# Altium project CCZynq.PrjPCB (part 1 of 2)
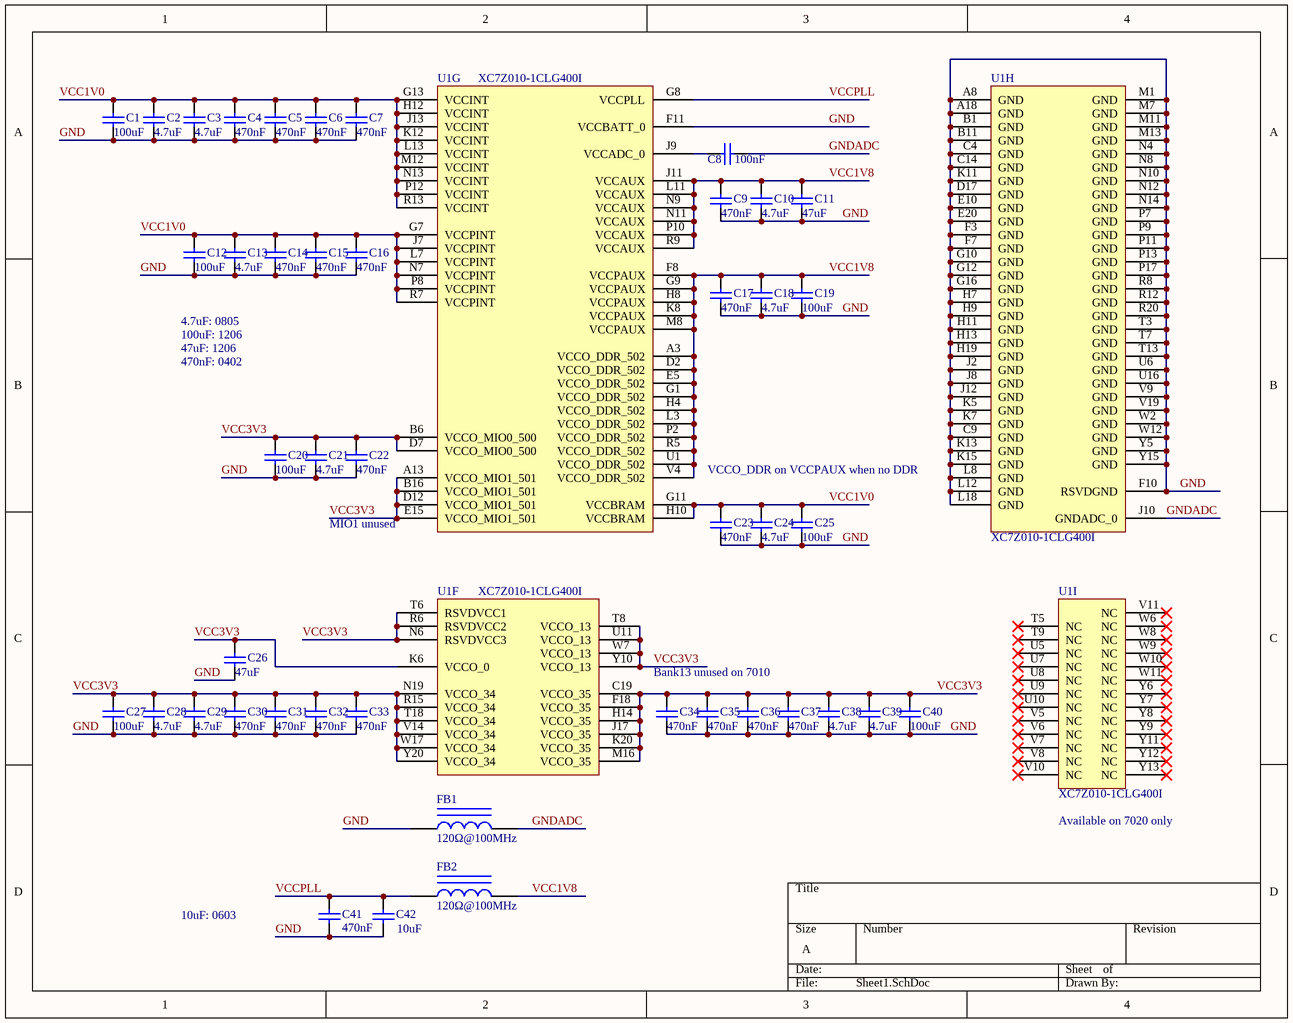
[diagram p0: Sheet1.SchDoc]
7 sheets, 247 parts. Net scope: global (net labels, ports and power ports of the same name join across sheets).
Board file: CCZynq.PcbDoc
Sheets:
  Sheet1.SchDoc
  Sheet2.SchDoc
  Sheet3.SchDoc
  Sheet4.SchDoc
  Sheet6.SchDoc
  Sheet5.SchDoc
  Sheet7.SchDoc

## Sheet Sheet1.SchDoc: SqueakyBoard
size A

### Parts
C1  100uF  [1206_C]
C2  4.7uF  [0805_C]
C3  4.7uF  [0805_C]
C4  470nF  [0402_C]
C5  470nF  [0402_C]
C6  470nF  [0402_C]
C7  470nF  [0402_C]
C8  100nF  [1206_C]
C9  470nF  [0402_C]
C10  4.7uF  [0805_C]
C11  47uF  [1206_C]
C12  100uF  [1206_C]
C13  4.7uF  [0805_C]
C14  470nF  [0402_C]
C15  470nF  [0402_C]
C16  470nF  [0402_C]
C17  470nF  [0402_C]
C18  4.7uF  [0805_C]
C19  100uF  [1206_C]
C20  100uF  [1206_C]
C21  4.7uF  [0805_C]
C22  470nF  [0402_C]
C23  470nF  [0402_C]
C24  4.7uF  [0805_C]
C25  100uF  [1206_C]
C26  47uF  [1206_C]
C27  100uF  [1206_C]
C28  4.7uF  [0805_C]
C29  4.7uF  [0805_C]
C30  470nF  [0402_C]
C31  470nF  [0402_C]
C32  470nF  [0402_C]
C33  470nF  [0402_C]
C34  470nF  [0402_C]
C35  470nF  [0402_C]
C36  470nF  [0402_C]
C37  470nF  [0402_C]
C38  4.7uF  [0805_C]
C39  4.7uF  [0805_C]
C40  100uF  [1206_C]
C41  470nF  [0402_C]
C42  10uF  [0603_C]
FB1  120Ω@100MHz  [0805_L]
FB2  120Ω@100MHz  [0805_L]
U1  XC7Z010-1CLG400I  [CLG400]  (parts F,G,H,I of 9)

### Nets
GND: C1.2 C2.2 C3.2 C4.2 C5.2 C6.2 C7.2 C9.1 C10.1 C11.1 C12.2 C13.2 C14.2 C15.2 C16.2 C17.1 C18.1 C19.1 C20.2 C21.2 C22.2 C23.1 C24.1 C25.1 C26.1 C27.2 C28.2 C29.2 C30.2 C31.2 C32.2 C33.2 C34.2 C35.2 C36.2 C37.2 C38.2 C39.2 C40.2 C41.1 C42.1 FB1.1 U1.A8(GND) U1.A18(GND) U1.B1(GND) U1.B11(GND) U1.C4(GND) U1.C9(GND) U1.C14(GND) U1.D17(GND) U1.E10(GND) U1.E20(GND) U1.F3(GND) U1.F7(GND) U1.F10(RSVDGND) U1.F11(VCCBATT_0) U1.G10(GND) U1.G12(GND) U1.G16(GND) U1.H7(GND) U1.H9(GND) U1.H11(GND) U1.H13(GND) U1.H19(GND) U1.J2(GND) U1.J8(GND) U1.J12(GND) U1.K5(GND) U1.K7(GND) U1.K11(GND) U1.K13(GND) U1.K15(GND) U1.L8(GND) U1.L12(GND) U1.L18(GND) U1.M1(GND) U1.M7(GND) U1.M11(GND) U1.M13(GND) U1.N4(GND) U1.N8(GND) U1.N10(GND) U1.N12(GND) U1.N14(GND) U1.P7(GND) U1.P9(GND) U1.P11(GND) U1.P13(GND) U1.P17(GND) U1.R8(GND) U1.R12(GND) U1.R20(GND) U1.T3(GND) U1.T7(GND) U1.T13(GND) U1.U6(GND) U1.U16(GND) U1.V9(GND) U1.V19(GND) U1.W2(GND) U1.W12(GND) U1.Y5(GND) U1.Y15(GND)
GNDADC: C8.2 FB1.2 U1.J10(GNDADC_0)
VCC1V0: C1.1 C2.1 C3.1 C4.1 C5.1 C6.1 C7.1 C12.1 C13.1 C14.1 C15.1 C16.1 C23.2 C24.2 C25.2 U1.G7(VCCPINT) U1.G11(VCCBRAM) U1.G13(VCCINT) U1.H10(VCCBRAM) U1.H12(VCCINT) U1.J7(VCCPINT) U1.J13(VCCINT) U1.K12(VCCINT) U1.L7(VCCPINT) U1.L13(VCCINT) U1.M12(VCCINT) U1.N7(VCCPINT) U1.N13(VCCINT) U1.P8(VCCPINT) U1.P12(VCCINT) U1.R7(VCCPINT) U1.R13(VCCINT)
VCC1V8: C9.2 C10.2 C11.2 C17.2 C18.2 C19.2 FB2.2 U1.A3(VCCO_DDR_502) U1.D2(VCCO_DDR_502) U1.E5(VCCO_DDR_502) U1.F8(VCCPAUX) U1.G1(VCCO_DDR_502) U1.G9(VCCPAUX) U1.H4(VCCO_DDR_502) U1.H8(VCCPAUX) U1.J11(VCCAUX) U1.K8(VCCPAUX) U1.L3(VCCO_DDR_502) U1.L11(VCCAUX) U1.M8(VCCPAUX) U1.N9(VCCAUX) U1.N11(VCCAUX) U1.P2(VCCO_DDR_502) U1.P10(VCCAUX) U1.R5(VCCO_DDR_502) U1.R9(VCCAUX) U1.U1(VCCO_DDR_502) U1.V4(VCCO_DDR_502)
VCC3V3: C20.1 C21.1 C22.1 C26.2 C27.1 C28.1 C29.1 C30.1 C31.1 C32.1 C33.1 C34.1 C35.1 C36.1 C37.1 C38.1 C39.1 C40.1 U1.A13(VCCO_MIO1_501) U1.B6(VCCO_MIO0_500) U1.B16(VCCO_MIO1_501) U1.C19(VCCO_35) U1.D7(VCCO_MIO0_500) U1.D12(VCCO_MIO1_501) U1.E15(VCCO_MIO1_501) U1.F18(VCCO_35) U1.H14(VCCO_35) U1.J17(VCCO_35) U1.K6(VCCO_0) U1.K20(VCCO_35) U1.M16(VCCO_35) U1.N6(RSVDVCC3) U1.N19(VCCO_34) U1.R6(RSVDVCC2) U1.R15(VCCO_34) U1.T6(RSVDVCC1) U1.T8(VCCO_13) U1.T18(VCCO_34) U1.U11(VCCO_13) U1.V14(VCCO_34) U1.W7(VCCO_13) U1.W17(VCCO_34) U1.Y10(VCCO_13) U1.Y20(VCCO_34)
VCCPLL: C41.2 C42.2 FB2.1 U1.G8(VCCPLL)
NetC8_1: C8.1 U1.J9(VCCADC_0)

Not connected (* = marked no-connect by the designer): U1 T5(NC)* T9(NC)* U5(NC)* U7(NC)* U8(NC)* U9(NC)* U10(NC)* V5(NC)* V6(NC)* V7(NC)* V8(NC)* V10(NC)* V11(NC)* W6(NC)* W8(NC)* W9(NC)* W10(NC)* W11(NC)* Y6(NC)* Y7(NC)* Y8(NC)* Y9(NC)* Y11(NC)* Y12(NC)* Y13(NC)*

### Notes on the sheet
- 4.7uF: 0805
- 100uF: 1206
- 47uF: 1206
- 470nF: 0402
- VCCO_DDR on VCCPAUX when no DDR
- MIO1 unused
- Bank13 unused on 7010
- (near U1) Available on 7020 only
- 10uF: 0603
- Title
- Size:
- Date:
- A
- Number:
- Time:
- Revision:
- Sheet
- of
- File:

### Library data of the parts
C1 C11 C12 C19 C20 C25-C27 C40 = 1206 10uF (106) 10% 50V: 贴片电容; ComponentLink1Description: 供应商链接; ComponentLink1URL: http://www.szlcsc.com/product/details_14236.html; Package: 1206; Supplier: LC; SuppliersPartNumber: C13585
C2 C3 C10 C13 C18 C21 C24 C28 C29 C38 C39 = 0805 4.7uF (475) 10% 25V: 贴片电容; ComponentLink1Description: 供应商链接; ComponentLink1URL: http://www.szlcsc.com/product/details_2131.html; Package: 0805; Supplier: LC; SuppliersPartNumber: C1779
C4-C7 C9 C14-C17 C22 C23 C30-C37 C41 = 0402 470nF (474) 10% 10V: 贴片电容; ComponentLink1Description: 供应商链接; ComponentLink1URL: http://www.szlcsc.com/product/details_48344.html; Package: 0402; Supplier: LC; SuppliersPartNumber: C47339
C8 = 1206 100nF (104) 10% 50V: 贴片电容; ComponentLink1Description: 供应商链接; ComponentLink1URL: http://www.szlcsc.com/product/details_25237.html; Package: 1206; Supplier: LC; SuppliersPartNumber: C24497
C42 = 0603 10uF (106) 10% 10V: 贴片电容; ComponentLink1Description: 供应商链接; ComponentLink1URL: http://www.szlcsc.com/product/details_20411.html; Package: 0603; Supplier: LC; SuppliersPartNumber: C19702
FB1 FB2 = 0805 600Ω 25% 100MHz: 贴片磁珠; ComponentLink1Description: 供应商链接; ComponentLink1URL: http://www.szlcsc.com/product/details_1369.html; Package: 0805; Supplier: LC; SuppliersPartNumber: C1017
U1 = XC7Z010-1CLG400I: 667 MHz Zynq?7000 AP SoC, 130 PS I/O, 100 FPGA I/O, 400-Ball BGA, Speed Grade 1, Industrial Grade, Pb-Free; Manufacturer: Xilinx; Extensible Block RAM (# 36Kb Blocks): 240 KB (60); Flip Flops: 35200; LUTs: 17600; Speed Grade: -1; DatasheetVersion: v1.2; PackageVersion: Rev 1.1; PackageReference: CLG400; PackageDescription: Wire-Bond Chip-Scale BGA, Body 17 x 17 mm, 0.8 mm Pitch; Generic Part Number: XC7Z010; RoHS: Pb-Free; Mounting Technology: Surface Mount; Code_JEDEC: MO-275-MMAA-1; PartNumber: XC7Z010-1CLG400I; ComponentLink1Description: Datasheet; ComponentLink1URL: http://www.xilinx.com/support/documentation/data_sheets/ds190-Zynq-7000-Overview.pdf; ComponentLink2Description: Package Specification; ComponentLink2URL: http://www.xilinx.com/support/documentation/user_guides/ug865-Zynq-7000-Pkg-Pinout.pdf; ComponentLink3Description: DC and AC Switching Characteristics; ComponentLink3URL: http://www.xilinx.com/support/documentation/data_sheets/ds187-XC7Z010-XC7Z020-Data-Sheet.pdf; ComponentLink4Description: Package File; ComponentLink4URL: http://www.xilinx.com/support/packagefiles/z7packages/xc7z010clg400pkg.txt; ComponentLink5Description: Packaging and Pinout; ComponentLink5URL: http://www.xilinx.com/support/documentation/user_guides/ug865-Zynq-7000-Pkg-Pinout.pdf; ComponentLink6Description: PCB and Layout Guide; ComponentLink6URL: http://www.xilinx.com/support/documentation/user_guides/ug483_7Series_PCB.pdf

## Sheet Sheet2.SchDoc
size A
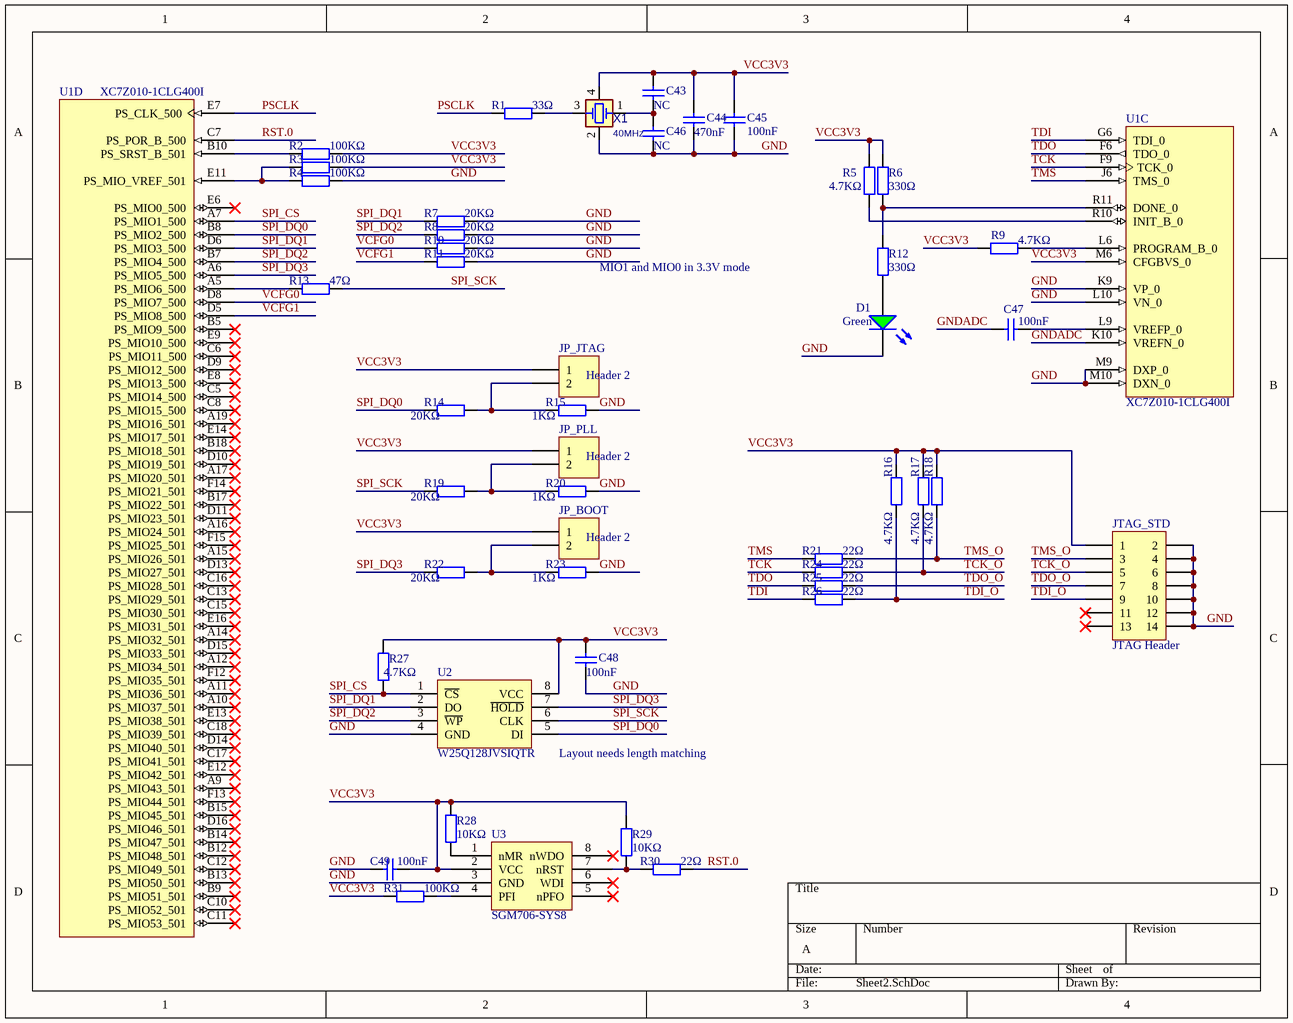
[diagram p1: Sheet2.SchDoc]

### Parts
C43  NC  [0402_C]
C44  470nF  [0402_C]
C45  100nF  [1206_C]
C46  NC  [0402_C]
C47  100nF  [1206_C]
C48  100nF  [1206_C]
C49  100nF  [1206_C]
D1  Green  [0805_LED_S1]
JP_BOOT  Header 2  [HDR1X2]
JP_JTAG  Header 2  [HDR1X2]
JP_PLL  Header 2  [HDR1X2]
JTAG_STD  JTAG Header  [HDR2X7]
R1  33Ω  [0603_R]
R2  100KΩ  [1206_R]
R3  100KΩ  [1206_R]
R4  100KΩ  [1206_R]
R5  4.7KΩ  [1206_R]
R6  330Ω  [0805_R]
R7  20KΩ  [0805_R]
R8  20KΩ  [0805_R]
R9  4.7KΩ  [1206_R]
R10  20KΩ  [0805_R]
R11  20KΩ  [0805_R]
R12  330Ω  [0805_R]
R13  47Ω  [0805_R]
R14  20KΩ  [0805_R]
R15  1KΩ  [1206_R]
R16  4.7KΩ  [1206_R]
R17  4.7KΩ  [1206_R]
R18  4.7KΩ  [1206_R]
R19  20KΩ  [0805_R]
R20  1KΩ  [1206_R]
R21  22Ω  [1206_R]
R22  20KΩ  [0805_R]
R23  1KΩ  [1206_R]
R24  22Ω  [1206_R]
R25  22Ω  [1206_R]
R26  22Ω  [1206_R]
R27  4.7KΩ  [1206_R]
R28  10KΩ  [1206_R]
R29  10KΩ  [1206_R]
R30  22Ω  [1206_R]
R31  100KΩ  [1206_R]
U1  XC7Z010-1CLG400I  [CLG400]  (parts C,D of 9)
U2  W25Q128JVSIQTR  [SOIC-8_208mil]
U3  SGM706-SYS8  [SOIC-8_150mil]
X1  40MHz  [XTL_4_3225]

### Nets
GND: C44.2 C45.1 C46.2 C48.1 C49.1 D1.K JTAG_STD.2 JTAG_STD.4 JTAG_STD.6 JTAG_STD.8 JTAG_STD.10 JTAG_STD.12 JTAG_STD.14 R4.2 R7.2 R8.2 R10.2 R11.2 R15.2 R20.2 R23.2 U1.K9(VP_0) U1.L10(VN_0) U1.M9(DXP_0) U1.M10(DXN_0) U2.4(GND) U3.3(GND) X1.2(GND1)
GNDADC: C47.1 U1.K10(VREFN_0)
PSCLK: R1.1 U1.E7(PS_CLK_500)
RST.0: R30.2 U1.C7(PS_POR_B_500)
SPI_CS: R27.1 U1.A7(PS_MIO1_500) U2.1(~{CS})
SPI_DQ0: R14.1 U1.B8(PS_MIO2_500) U2.5(DI)
SPI_DQ1: R7.1 U1.D6(PS_MIO3_500) U2.2(DO)
SPI_DQ2: R8.1 U1.B7(PS_MIO4_500) U2.3(~{WP})
SPI_DQ3: R22.1 U1.A6(PS_MIO5_500) U2.7(~{HOLD})
SPI_SCK: R13.2 R19.1 U2.6(CLK)
TCK: R24.1 U1.F9(TCK_0)
TCK_O: JTAG_STD.5 R17.1 R24.2
TDI: R26.1 U1.G6(TDI_0)
TDI_O: JTAG_STD.9 R16.1 R26.2
TDO: R25.1 U1.F6(TDO_0)
TDO_O: JTAG_STD.7 R25.2
TMS: R21.1 U1.J6(TMS_0)
TMS_O: JTAG_STD.3 R18.1 R21.2
VCC3V3: C43.1 C44.1 C45.2 C48.2 C49.2 JP_BOOT.1 JP_JTAG.1 JP_PLL.1 JTAG_STD.1 R2.2 R3.2 R5.2 R6.1 R9.1 R16.2 R17.2 R18.2 R27.2 R28.2 R29.2 R31.1 U1.M6(CFGBVS_0) U2.8(VCC) U3.2(VCC) X1.4(GND2)
VCFG0: R10.1 U1.D8(PS_MIO7_500)
VCFG1: R11.1 U1.D5(PS_MIO8_500)
NetC43_2: C43.2 C46.1 X1.1(XA)
NetC47_2: C47.2 U1.L9(VREFP_0)
NetD1_A: D1.A R12.1
NetJP_BOOT_2: JP_BOOT.2 R22.2 R23.1
NetJP_JTAG_2: JP_JTAG.2 R14.2 R15.1
NetJP_PLL_2: JP_PLL.2 R19.2 R20.1
NetR1_2: R1.2 X1.3(XB)
NetR2_1: R2.1 U1.B10(PS_SRST_B_501)
NetR3_1: R3.1 R4.1 U1.E11(PS_MIO_VREF_501)
NetR5_1: R5.1 U1.R10(INIT_B_0)
NetR6_2: R6.2 R12.2 U1.R11(DONE_0)
NetR9_2: R9.2 U1.L6(PROGRAM_B_0)
NetR13_1: R13.1 U1.A5(PS_MIO6_500)
NetR28_1: R28.1 U3.1(nMR)
NetR29_1: R29.1 R30.1 U3.7(nRST)
NetR31_2: R31.2 U3.4(PFI)

Not connected (* = marked no-connect by the designer): JTAG_STD 11* 13*; U1 A9(PS_MIO43_501)* A10(PS_MIO37_501)* A11(PS_MIO36_501)* A12(PS_MIO34_501)* A14(PS_MIO32_501)* A15(PS_MIO26_501)* A16(PS_MIO24_501)* A17(PS_MIO20_501)* A19(PS_MIO16_501)* B5(PS_MIO9_500)* B9(PS_MIO51_501)* B12(PS_MIO48_501)* B13(PS_MIO50_501)* B14(PS_MIO47_501)* B15(PS_MIO45_501)* B17(PS_MIO22_501)* B18(PS_MIO18_501)* C5(PS_MIO14_500)* C6(PS_MIO11_500)* C8(PS_MIO15_500)* C10(PS_MIO52_501)* C11(PS_MIO53_501)* C12(PS_MIO49_501)* C13(PS_MIO29_501)* C15(PS_MIO30_501)* C16(PS_MIO28_501)* C17(PS_MIO41_501)* C18(PS_MIO39_501)* D9(PS_MIO12_500)* D10(PS_MIO19_501)* D11(PS_MIO23_501)* D13(PS_MIO27_501)* D14(PS_MIO40_501)* D15(PS_MIO33_501)* D16(PS_MIO46_501)* E6(PS_MIO0_500)* E8(PS_MIO13_500)* E9(PS_MIO10_500)* E12(PS_MIO42_501)* E13(PS_MIO38_501)* E14(PS_MIO17_501)* E16(PS_MIO31_501)* F12(PS_MIO35_501)* F13(PS_MIO44_501)* F14(PS_MIO21_501)* F15(PS_MIO25_501)*; U3 5(nPFO)* 6(WDI)* 8(nWDO)*

### Notes on the sheet
- MIO1 and MIO0 in 3.3V mode
- (near U2) Layout needs length matching
- Title
- Size:
- Date:
- A
- Number:
- Time:
- Revision:
- Sheet
- of
- File:

### Library data of the parts
C43 C44 C46 = 0402 470nF (474) 10% 10V: 贴片电容; ComponentLink1Description: 供应商链接; ComponentLink1URL: http://www.szlcsc.com/product/details_48344.html; Package: 0402; Supplier: LC; SuppliersPartNumber: C47339
C45 C47-C49 = 1206 100nF (104) 10% 50V: 贴片电容; ComponentLink1Description: 供应商链接; ComponentLink1URL: http://www.szlcsc.com/product/details_25237.html; Package: 1206; Supplier: LC; SuppliersPartNumber: C24497
D1 = 0805 翠绿: 发光二极管; ComponentLink1Description: 供应商链接; ComponentLink1URL: http://www.szlcsc.com/product/details_2670.html; Package: 0805; Supplier: LC; SuppliersPartNumber: C2297
JP_BOOT JP_JTAG JP_PLL = Header 2: Header, 2-Pin; LatestRevisionDate: 17-Jul-2002; LatestRevisionNote: Re-released for DXP Platform.; Publisher: Altium Limited
JTAG_STD = Header 7X2: Header, 7-Pin, Dual row; LatestRevisionDate: 17-Jul-2002; LatestRevisionNote: Re-released for DXP Platform.; Publisher: Altium Limited
R1 = 0603 33Ω (33R0) 1%: 贴片电阻; ComponentLink1Description: 供应商链接; ComponentLink1URL: http://www.szlcsc.com/product/details_23867.html; Package: 0603; Supplier: LC; SuppliersPartNumber: C23140
R2-R4 R31 = 1206 100KΩ (1003) 1%: 贴片电阻; ComponentLink1Description: 供应商链接; ComponentLink1URL: http://www.szlcsc.com/product/details_18588.html; Package: 1206; Supplier: LC; SuppliersPartNumber: C17900
R5 R9 R16-R18 R27 = 1206 4.7KΩ (4701) 1%: 贴片电阻; ComponentLink1Description: 供应商链接; ComponentLink1URL: http://www.szlcsc.com/product/details_18624.html; Package: 1206; Supplier: LC; SuppliersPartNumber: C17936
R6 R12 = 0805 330Ω (3300) 1%: 贴片电阻; ComponentLink1Description: 供应商链接; ComponentLink1URL: http://www.szlcsc.com/product/details_18318.html; Package: 0805; Supplier: LC; SuppliersPartNumber: C17630
R7 R8 R10 R11 R14 R19 R22 = 0805 20KΩ (2002) 1%: 贴片电阻; ComponentLink1Description: 供应商链接; ComponentLink1URL: http://www.szlcsc.com/product/details_4735.html; Package: 0805; Supplier: LC; SuppliersPartNumber: C4328
R13 = 0805 47Ω (47R0) 1%: 贴片电阻; ComponentLink1Description: 供应商链接; ComponentLink1URL: http://www.szlcsc.com/product/details_18402.html; Package: 0805; Supplier: LC; SuppliersPartNumber: C17714
R15 R20 R23 = 1206 1KΩ (1001) 1%: 贴片电阻; ComponentLink1Description: 供应商链接; ComponentLink1URL: http://www.szlcsc.com/product/details_4817.html; Package: 1206; Supplier: LC; SuppliersPartNumber: C4410
R21 R24-R26 R30 = 1206 22Ω (22R0) 1%: 贴片电阻; ComponentLink1Description: 供应商链接; ComponentLink1URL: http://www.szlcsc.com/product/details_18646.html; Package: 1206; Supplier: LC; SuppliersPartNumber: C17958
R28 R29 = 1206 10KΩ (1002) 1%: 贴片电阻; ComponentLink1Description: 供应商链接; ComponentLink1URL: http://www.szlcsc.com/product/details_18590.html; Package: 1206; Supplier: LC; SuppliersPartNumber: C17902
U1 = XC7Z010-1CLG400I: as U1 on sheet Sheet1; DatasheetVersion: v1.2; PackageVersion: Rev 1.1; PackageReference: CLG400; PackageDescription: Wire-Bond Chip-Scale BGA, Body 17 x 17 mm, 0.8 mm Pitch; Generic Part Number: XC7Z010; RoHS: Pb-Free; Mounting Technology: Surface Mount; Code_JEDEC: MO-275-MMAA-1; PartNumber: XC7Z010-1CLG400I; ComponentLink1Description: Datasheet; ComponentLink1URL: http://www.xilinx.com/support/documentation/data_sheets/ds190-Zynq-7000-Overview.pdf; ComponentLink2Description: Package Specification; ComponentLink2URL: http://www.xilinx.com/support/documentation/user_guides/ug865-Zynq-7000-Pkg-Pinout.pdf; ComponentLink3Description: DC and AC Switching Characteristics; ComponentLink3URL: http://www.xilinx.com/support/documentation/data_sheets/ds187-XC7Z010-XC7Z020-Data-Sheet.pdf; ComponentLink4Description: Package File; ComponentLink4URL: http://www.xilinx.com/support/packagefiles/z7packages/xc7z010clg400pkg.txt; ComponentLink5Description: Packaging and Pinout; ComponentLink5URL: http://www.xilinx.com/support/documentation/user_guides/ug865-Zynq-7000-Pkg-Pinout.pdf; ComponentLink6Description: PCB and Layout Guide; ComponentLink6URL: http://www.xilinx.com/support/documentation/user_guides/ug483_7Series_PCB.pdf
U2 = W25Q128JVSIQTR_[C97521]: Flash ROM; ComponentLink1Description: 供应商链接; ComponentLink1URL: https://item.szlcsc.com/98729.html; Package: SOIC-8; Supplier: LC; SuppliersPartNumber: C97521
U3 = EEPROM/AT24C256C-SSHL-T_[C6482]: MCU  Supervisor, 150mil SOP-8; ComponentLink1Description: 供应商链接; ComponentLink1URL: http://www.szlcsc.com/product/details_6947.html; Package: SOIC-8_150mil; Supplier: LC; SuppliersPartNumber: C6482
X1 = XTL_4_40MHz_3225A: CRYSTAL 40.00 MHZ 4pF, 10PPM; MANF: ABRACON; DESC: X1E000021036701; DIST#: MOUSER; MANF_P#: ABM8W-40.0000MHZ-4-B1U-T3; PARAM2: 4pF, 40OhmESR; PARAM: 10PPM, -20~70oC; ASSEMBLY: ASSEMBLY; PRICE: 0.6$; VALUE: 40MHz

## Sheet Sheet3.SchDoc
size A
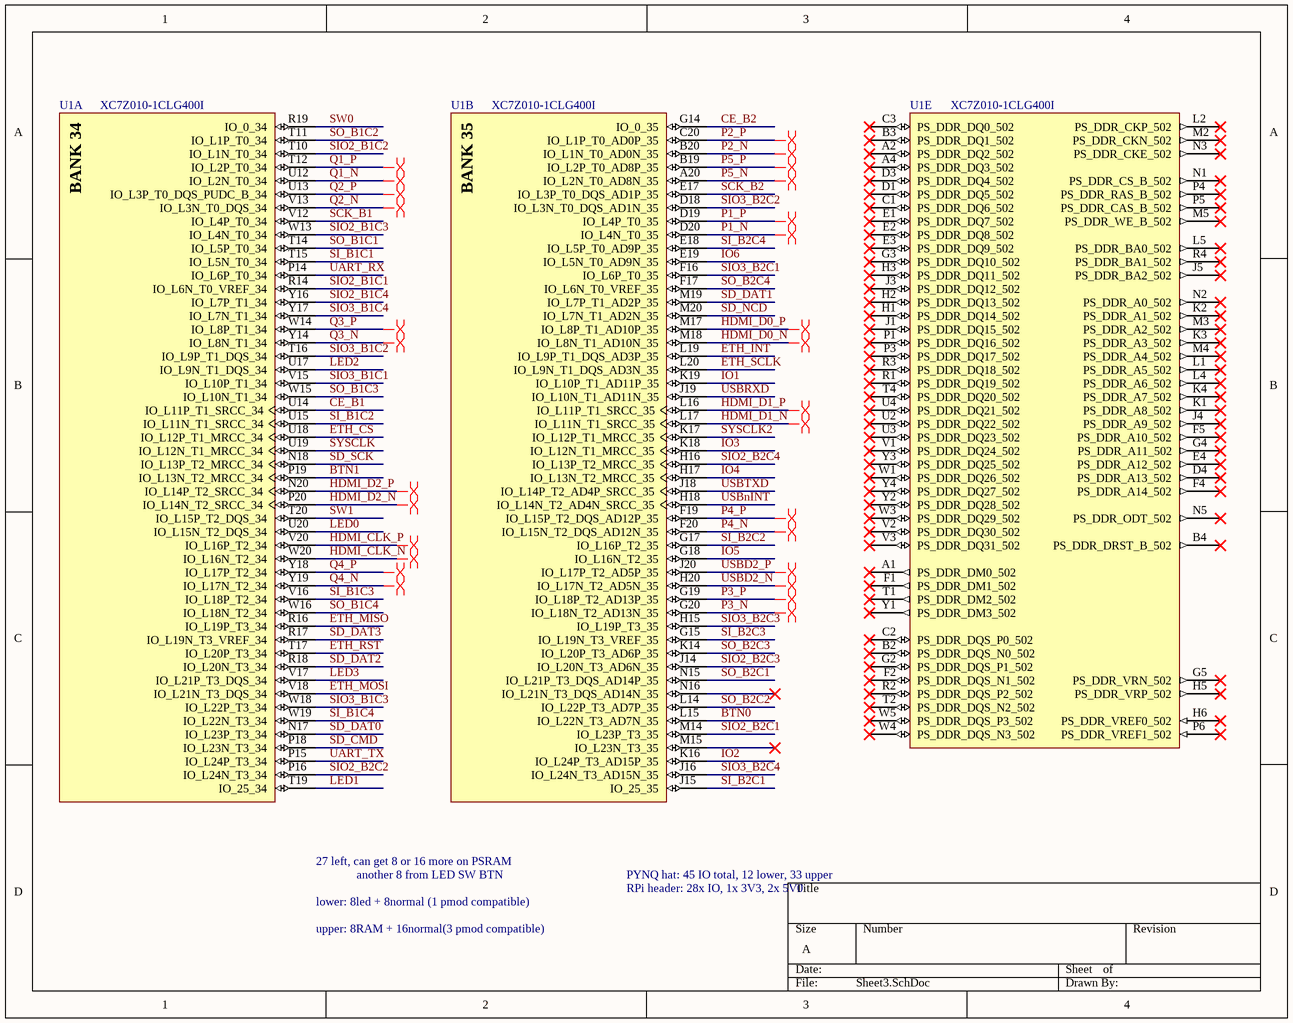
[diagram p2: Sheet3.SchDoc]

### Parts
U1  XC7Z010-1CLG400I  [CLG400]  (parts A,B,E of 9)

### Nets
BTN0: U1.L15(IO_L22N_T3_AD7N_35)
BTN1: U1.P19(IO_L13N_T2_MRCC_34)
CE_B1: U1.U14(IO_L11P_T1_SRCC_34)
CE_B2: U1.G14(IO_0_35)
ETH_CS: U1.U18(IO_L12P_T1_MRCC_34)
ETH_INT: U1.L19(IO_L9P_T1_DQS_AD3P_35)
ETH_MISO: U1.R16(IO_L19P_T3_34)
ETH_MOSI: U1.V18(IO_L21N_T3_DQS_34)
ETH_RST: U1.T17(IO_L20P_T3_34)
ETH_SCLK: U1.L20(IO_L9N_T1_DQS_AD3N_35)
HDMI_CLK_N: U1.W20(IO_L16N_T2_34)
HDMI_CLK_P: U1.V20(IO_L16P_T2_34)
HDMI_D0_N: U1.M18(IO_L8N_T1_AD10N_35)
HDMI_D0_P: U1.M17(IO_L8P_T1_AD10P_35)
HDMI_D1_N: U1.L17(IO_L11N_T1_SRCC_35)
HDMI_D1_P: U1.L16(IO_L11P_T1_SRCC_35)
HDMI_D2_N: U1.P20(IO_L14N_T2_SRCC_34)
HDMI_D2_P: U1.N20(IO_L14P_T2_SRCC_34)
IO1: U1.K19(IO_L10P_T1_AD11P_35)
IO2: U1.K16(IO_L24P_T3_AD15P_35)
IO3: U1.K18(IO_L12N_T1_MRCC_35)
IO4: U1.H17(IO_L13N_T2_MRCC_35)
IO5: U1.G18(IO_L16N_T2_35)
IO6: U1.E19(IO_L5N_T0_AD9N_35)
LED0: U1.U20(IO_L15N_T2_DQS_34)
LED1: U1.T19(IO_25_34)
LED2: U1.U17(IO_L9N_T1_DQS_34)
LED3: U1.V17(IO_L21P_T3_DQS_34)
P1_N: U1.D20(IO_L4N_T0_35)
P1_P: U1.D19(IO_L4P_T0_35)
P2_N: U1.B20(IO_L1N_T0_AD0N_35)
P2_P: U1.C20(IO_L1P_T0_AD0P_35)
P3_N: U1.G20(IO_L18N_T2_AD13N_35)
P3_P: U1.G19(IO_L18P_T2_AD13P_35)
P4_N: U1.F20(IO_L15N_T2_DQS_AD12N_35)
P4_P: U1.F19(IO_L15P_T2_DQS_AD12P_35)
P5_N: U1.A20(IO_L2N_T0_AD8N_35)
P5_P: U1.B19(IO_L2P_T0_AD8P_35)
Q1_N: U1.U12(IO_L2N_T0_34)
Q1_P: U1.T12(IO_L2P_T0_34)
Q2_N: U1.V13(IO_L3N_T0_DQS_34)
Q2_P: U1.U13(IO_L3P_T0_DQS_PUDC_B_34)
Q3_N: U1.Y14(IO_L8N_T1_34)
Q3_P: U1.W14(IO_L8P_T1_34)
Q4_N: U1.Y19(IO_L17N_T2_34)
Q4_P: U1.Y18(IO_L17P_T2_34)
SCK_B1: U1.V12(IO_L4P_T0_34)
SCK_B2: U1.E17(IO_L3P_T0_DQS_AD1P_35)
SD_CMD: U1.P18(IO_L23N_T3_34)
SD_DAT0: U1.N17(IO_L23P_T3_34)
SD_DAT1: U1.M19(IO_L7P_T1_AD2P_35)
SD_DAT2: U1.R18(IO_L20N_T3_34)
SD_DAT3: U1.R17(IO_L19N_T3_VREF_34)
SD_NCD: U1.M20(IO_L7N_T1_AD2N_35)
SD_SCK: U1.N18(IO_L13P_T2_MRCC_34)
SI_B1C1: U1.T15(IO_L5N_T0_34)
SI_B1C2: U1.U15(IO_L11N_T1_SRCC_34)
SI_B1C3: U1.V16(IO_L18P_T2_34)
SI_B1C4: U1.W19(IO_L22N_T3_34)
SI_B2C1: U1.J15(IO_25_35)
SI_B2C2: U1.G17(IO_L16P_T2_35)
SI_B2C3: U1.G15(IO_L19N_T3_VREF_35)
SI_B2C4: U1.E18(IO_L5P_T0_AD9P_35)
SIO2_B1C1: U1.R14(IO_L6N_T0_VREF_34)
SIO2_B1C2: U1.T10(IO_L1N_T0_34)
SIO2_B1C3: U1.W13(IO_L4N_T0_34)
SIO2_B1C4: U1.Y16(IO_L7P_T1_34)
SIO2_B2C1: U1.M14(IO_L23P_T3_35)
SIO2_B2C2: U1.P16(IO_L24N_T3_34)
SIO2_B2C3: U1.J14(IO_L20N_T3_AD6N_35)
SIO2_B2C4: U1.H16(IO_L13P_T2_MRCC_35)
SIO3_B1C1: U1.V15(IO_L10P_T1_34)
SIO3_B1C2: U1.T16(IO_L9P_T1_DQS_34)
SIO3_B1C3: U1.W18(IO_L22P_T3_34)
SIO3_B1C4: U1.Y17(IO_L7N_T1_34)
SIO3_B2C1: U1.F16(IO_L6P_T0_35)
SIO3_B2C2: U1.D18(IO_L3N_T0_DQS_AD1N_35)
SIO3_B2C3: U1.H15(IO_L19P_T3_35)
SIO3_B2C4: U1.J16(IO_L24N_T3_AD15N_35)
SO_B1C1: U1.T14(IO_L5P_T0_34)
SO_B1C2: U1.T11(IO_L1P_T0_34)
SO_B1C3: U1.W15(IO_L10N_T1_34)
SO_B1C4: U1.W16(IO_L18N_T2_34)
SO_B2C1: U1.N15(IO_L21P_T3_DQS_AD14P_35)
SO_B2C2: U1.L14(IO_L22P_T3_AD7P_35)
SO_B2C3: U1.K14(IO_L20P_T3_AD6P_35)
SO_B2C4: U1.F17(IO_L6N_T0_VREF_35)
SW0: U1.R19(IO_0_34)
SW1: U1.T20(IO_L15P_T2_DQS_34)
SYSCLK: U1.U19(IO_L12N_T1_MRCC_34)
SYSCLK2: U1.K17(IO_L12P_T1_MRCC_35)
UART_RX: U1.P14(IO_L6P_T0_34)
UART_TX: U1.P15(IO_L24P_T3_34)
USBD2_N: U1.H20(IO_L17N_T2_AD5N_35)
USBD2_P: U1.J20(IO_L17P_T2_AD5P_35)
USBnINT: U1.H18(IO_L14N_T2_AD4N_SRCC_35)
USBRXD: U1.J19(IO_L10N_T1_AD11N_35)
USBTXD: U1.J18(IO_L14P_T2_AD4P_SRCC_35)

Not connected (* = marked no-connect by the designer): U1 A1(PS_DDR_DM0_502)* A2(PS_DDR_DQ2_502)* A4(PS_DDR_DQ3_502)* B2(PS_DDR_DQS_N0_502)* B3(PS_DDR_DQ1_502)* B4(PS_DDR_DRST_B_502)* C1(PS_DDR_DQ6_502)* C2(PS_DDR_DQS_P0_502)* C3(PS_DDR_DQ0_502)* D1(PS_DDR_DQ5_502)* D3(PS_DDR_DQ4_502)* D4(PS_DDR_A13_502)* E1(PS_DDR_DQ7_502)* E2(PS_DDR_DQ8_502)* E3(PS_DDR_DQ9_502)* E4(PS_DDR_A12_502)* F1(PS_DDR_DM1_502)* F2(PS_DDR_DQS_N1_502)* F4(PS_DDR_A14_502)* F5(PS_DDR_A10_502)* G2(PS_DDR_DQS_P1_502)* G3(PS_DDR_DQ10_502)* G4(PS_DDR_A11_502)* G5(PS_DDR_VRN_502)* H1(PS_DDR_DQ14_502)* H2(PS_DDR_DQ13_502)* H3(PS_DDR_DQ11_502)* H5(PS_DDR_VRP_502)* H6(PS_DDR_VREF0_502)* J1(PS_DDR_DQ15_502)* J3(PS_DDR_DQ12_502)* J4(PS_DDR_A9_502)* J5(PS_DDR_BA2_502)* K1(PS_DDR_A8_502)* K2(PS_DDR_A1_502)* K3(PS_DDR_A3_502)* K4(PS_DDR_A7_502)* L1(PS_DDR_A5_502)* L2(PS_DDR_CKP_502)* L4(PS_DDR_A6_502)* L5(PS_DDR_BA0_502)* M2(PS_DDR_CKN_502)* M3(PS_DDR_A2_502)* M4(PS_DDR_A4_502)* M5(PS_DDR_WE_B_502)* M15(IO_L23N_T3_35)* N1(PS_DDR_CS_B_502)* N2(PS_DDR_A0_502)* N3(PS_DDR_CKE_502)* N5(PS_DDR_ODT_502)* N16(IO_L21N_T3_DQS_AD14N_35)* P1(PS_DDR_DQ16_502)* P3(PS_DDR_DQ17_502)* P4(PS_DDR_RAS_B_502)* P5(PS_DDR_CAS_B_502)* P6(PS_DDR_VREF1_502)* R1(PS_DDR_DQ19_502)* R2(PS_DDR_DQS_P2_502)* R3(PS_DDR_DQ18_502)* R4(PS_DDR_BA1_502)* T1(PS_DDR_DM2_502)* T2(PS_DDR_DQS_N2_502)* T4(PS_DDR_DQ20_502)* U2(PS_DDR_DQ22_502)* U3(PS_DDR_DQ23_502)* U4(PS_DDR_DQ21_502)* V1(PS_DDR_DQ24_502)* V2(PS_DDR_DQ30_502)* V3(PS_DDR_DQ31_502)* W1(PS_DDR_DQ26_502)* W3(PS_DDR_DQ29_502)* W4(PS_DDR_DQS_N3_502)* W5(PS_DDR_DQS_P3_502)* Y1(PS_DDR_DM3_502)* Y2(PS_DDR_DQ28_502)* Y3(PS_DDR_DQ25_502)* Y4(PS_DDR_DQ27_502)*

### Layout directives
differential pair: HDMI_CLK_N, HDMI_CLK_P, HDMI_D0_N, HDMI_D0_P, HDMI_D1_N, HDMI_D1_P, HDMI_D2_N, HDMI_D2_P, P1_N, P1_P, P2_N, P2_P, P3_N, P3_P, P4_N, P4_P, P5_N, P5_P, Q1_N, Q1_P, Q2_N, Q2_P, Q3_N, Q3_P, Q4_N, Q4_P, USBD2_N, USBD2_P

### Notes on the sheet
- 27 left, can get 8 or 16 more on PSRAM
- lower: 8led + 8normal (1 pmod compatible)
- another 8 from LED SW BTN
- PYNQ hat: 45 IO total, 12 lower, 33 upper
- RPi header: 28x IO, 1x 3V3, 2x 5V0
- upper: 8RAM + 16normal(3 pmod compatible)
- (in symbol XC7Z010-1CLG400I, part A) BANK 34
- (in symbol XC7Z010-1CLG400I, part B) BANK 35

### Library data of the parts
U1 = XC7Z010-1CLG400I: as U1 on sheet Sheet1; DatasheetVersion: v1.2; PackageVersion: Rev 1.1; PackageReference: CLG400; PackageDescription: Wire-Bond Chip-Scale BGA, Body 17 x 17 mm, 0.8 mm Pitch; Generic Part Number: XC7Z010; RoHS: Pb-Free; Mounting Technology: Surface Mount; Code_JEDEC: MO-275-MMAA-1; PartNumber: XC7Z010-1CLG400I; ComponentLink1Description: Datasheet; ComponentLink1URL: http://www.xilinx.com/support/documentation/data_sheets/ds190-Zynq-7000-Overview.pdf; ComponentLink2Description: Package Specification; ComponentLink2URL: http://www.xilinx.com/support/documentation/user_guides/ug865-Zynq-7000-Pkg-Pinout.pdf; ComponentLink3Description: DC and AC Switching Characteristics; ComponentLink3URL: http://www.xilinx.com/support/documentation/data_sheets/ds187-XC7Z010-XC7Z020-Data-Sheet.pdf; ComponentLink4Description: Package File; ComponentLink4URL: http://www.xilinx.com/support/packagefiles/z7packages/xc7z010clg400pkg.txt; ComponentLink5Description: Packaging and Pinout; ComponentLink5URL: http://www.xilinx.com/support/documentation/user_guides/ug865-Zynq-7000-Pkg-Pinout.pdf; ComponentLink6Description: PCB and Layout Guide; ComponentLink6URL: http://www.xilinx.com/support/documentation/user_guides/ug483_7Series_PCB.pdf

## Sheet Sheet4.SchDoc
size A
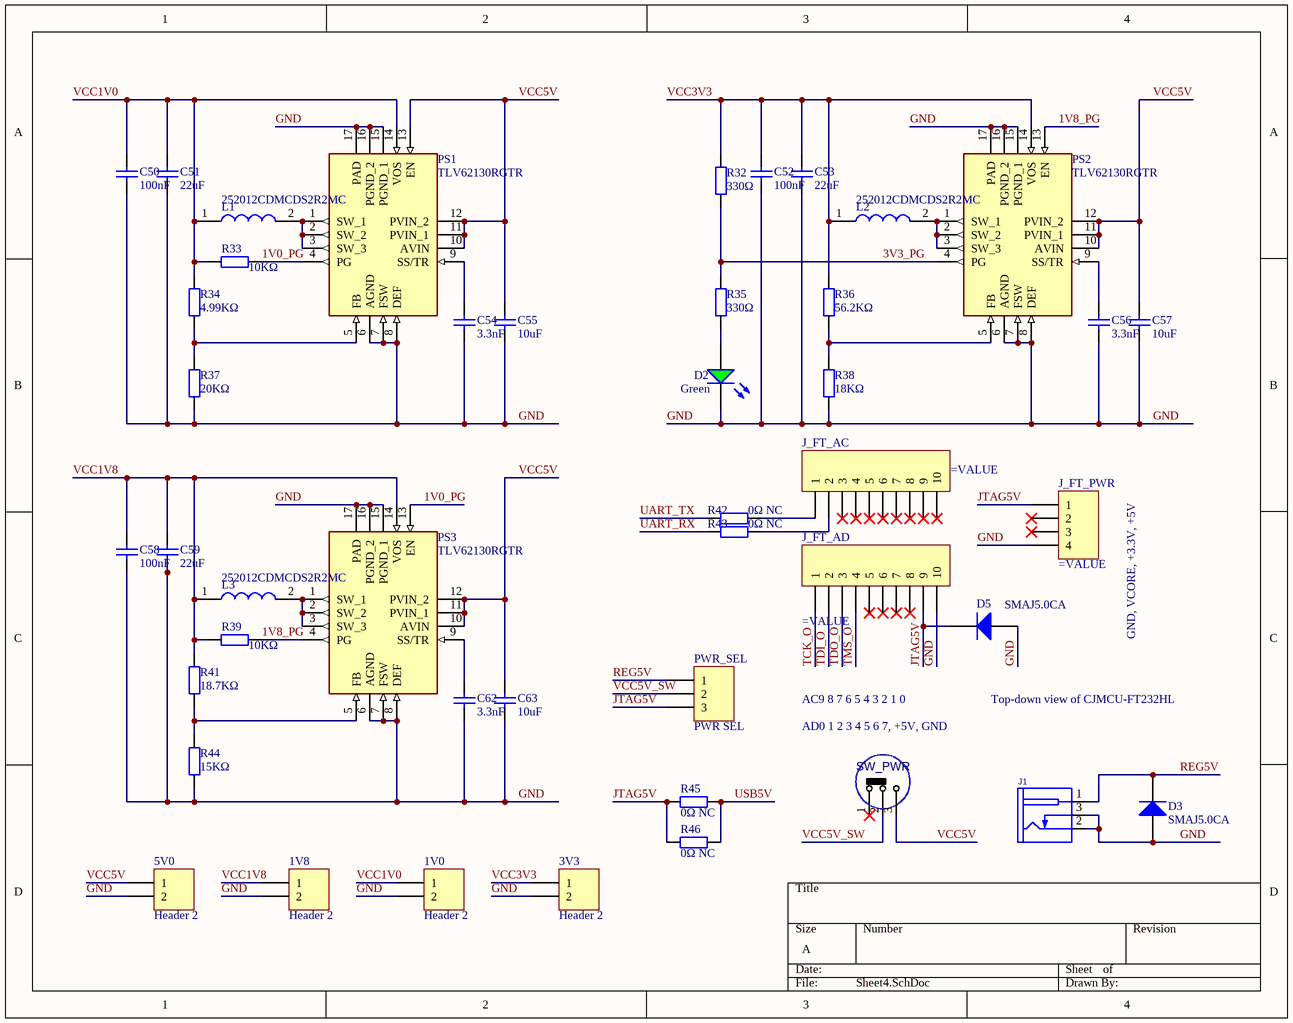
[diagram p3: Sheet4.SchDoc]

### Parts
1V0  Header 2  [HDR1X2]
1V8  Header 2  [HDR1X2]
3V3  Header 2  [HDR1X2]
5V0  Header 2  [HDR1X2]
C50  100nF  [1206_C]
C51  22uF  [0805_C]
C52  100nF  [1206_C]
C53  22uF  [0805_C]
C54  3.3nF  [0805_C]
C55  10uF  [1206_C]
C56  3.3nF  [0805_C]
C57  10uF  [1206_C]
C58  100nF  [1206_C]
C59  22uF  [0805_C]
C62  3.3nF  [0805_C]
C63  10uF  [1206_C]
D2  Green  [0805_LED_S1]
D3  SMAJ5.0CA  [SMA(DO-214AC)_S1]
D5  SMAJ5.0CA  [SMA(DO-214AC)_S1]
J1  DC_POWER_JACK  [JAC_PWR2MM]  (value not drawn)
J_FT_AC  (no value)  [HDR1X10]
J_FT_AD  (no value)  [HDR1X10]
J_FT_PWR  (no value)  [HDR1X4]
L1  252012CDMCDS2R2MC  [INDPM2520X120N]
L2  252012CDMCDS2R2MC  [INDPM2520X120N]
L3  252012CDMCDS2R2MC  [INDPM2520X120N]
PS1  TLV62130RGTR  [QFN50P300X300X100-17N-D]
PS2  TLV62130RGTR  [QFN50P300X300X100-17N-D]
PS3  TLV62130RGTR  [QFN50P300X300X100-17N-D]
PWR_SEL  PWR SEL  [HDR1X3]
R32  330Ω  [0805_R]
R33  10KΩ  [1206_R]
R34  4.99KΩ  [0805_R]
R35  330Ω  [0805_R]
R36  56.2KΩ  [0805_R]
R37  20KΩ  [0805_R]
R38  18KΩ  [0805_R]
R39  10KΩ  [1206_R]
R41  18.7KΩ  [0805_R]
R42  0Ω NC  [0805_R]
R43  0Ω NC  [0805_R]
R44  15KΩ  [0805_R]
R45  0Ω NC  [0805_R]
R46  0Ω NC  [0805_R]
SW_PWR  SlideSwitch  [SWSLIDT_SPDT_S_8X4]  (value not drawn)

### Nets
1V0_PG: PS1.4(PG) PS3.13(EN) R33.2
1V8_PG: PS2.13(EN) PS3.4(PG) R39.2
3V3_PG: PS2.4(PG) R32.1 R35.2
GND: 1V0.2 1V8.2 3V3.2 5V0.2 C50.1 C51.1 C52.1 C53.1 C54.1 C55.1 C56.1 C57.1 C58.1 C59.1 C62.1 C63.1 D2.K D3.1(A) D5.1(A) J1.2(SLEEVE) J1.3(INSERTION_DET) J_FT_AD.10 J_FT_PWR.4 PS1.6(AGND) PS1.7(FSW) PS1.8(DEF) PS1.15(PGND_1) PS1.16(PGND_2) PS1.17(PAD) PS2.6(AGND) PS2.7(FSW) PS2.8(DEF) PS2.15(PGND_1) PS2.16(PGND_2) PS2.17(PAD) PS3.6(AGND) PS3.7(FSW) PS3.8(DEF) PS3.15(PGND_1) PS3.16(PGND_2) PS3.17(PAD) R37.1 R38.1 R44.1
JTAG5V: D5.2(K) J_FT_AD.9 J_FT_PWR.1 PWR_SEL.3 R45.1 R46.1
REG5V: D3.2(K) J1.1(TIP) PWR_SEL.1
TCK_O: J_FT_AD.1
TDI_O: J_FT_AD.2
TDO_O: J_FT_AD.3
TMS_O: J_FT_AD.4
UART_RX: R43.1
UART_TX: R42.1
USB5V: R45.2 R46.2
VCC1V0: 1V0.1 C50.2 C51.2 L1.1 PS1.14(VOS) R33.1 R34.2
VCC1V8: 1V8.1 C58.2 C59.2 L3.1 PS3.14(VOS) R39.1 R41.2
VCC3V3: 3V3.1 C52.2 C53.2 L2.1 PS2.14(VOS) R32.2 R36.2
VCC5V: 5V0.1 C55.2 C57.2 C63.2 PS1.10(AVIN) PS1.11(PVIN_1) PS1.12(PVIN_2) PS1.13(EN) PS2.10(AVIN) PS2.11(PVIN_1) PS2.12(PVIN_2) PS3.10(AVIN) PS3.11(PVIN_1) PS3.12(PVIN_2) SW_PWR.3(P4)
VCC5V_SW: PWR_SEL.2 SW_PWR.2(P3)
NetC54_2: C54.2 PS1.9(SS/TR)
NetC56_2: C56.2 PS2.9(SS/TR)
NetC62_2: C62.2 PS3.9(SS/TR)
NetD2_A: D2.A R35.1
NetJ_FT_AC_1: J_FT_AC.1 R42.2
NetJ_FT_AC_2: J_FT_AC.2 R43.2
NetL1_2: L1.2 PS1.1(SW_1) PS1.2(SW_2) PS1.3(SW_3)
NetL2_2: L2.2 PS2.1(SW_1) PS2.2(SW_2) PS2.3(SW_3)
NetL3_2: L3.2 PS3.1(SW_1) PS3.2(SW_2) PS3.3(SW_3)
NetPS1_5: PS1.5(FB) R34.1 R37.2
NetPS2_5: PS2.5(FB) R36.1 R38.2
NetPS3_5: PS3.5(FB) R41.1 R44.2

Not connected (* = marked no-connect by the designer): J_FT_AC 3* 4* 5* 6* 7* 8* 9* 10*; J_FT_AD 5* 6* 7* 8*; J_FT_PWR 2* 3*; SW_PWR 1(P1)*

### Notes on the sheet
- GND, VCORE, +3.3V, +5V
- AC9 8 7 6 5 4 3 2 1 0
- Top-down view of CJMCU-FT232HL
- AD0 1 2 3 4 5 6 7, +5V, GND

### Library data of the parts
1V0 1V8 3V3 5V0 = Header 2: Header, 2-Pin; LatestRevisionDate: 17-Jul-2002; LatestRevisionNote: Re-released for DXP Platform.; Publisher: Altium Limited
C50 C52 C58 = 1206 100nF (104) 10% 50V: 贴片电容; ComponentLink1Description: 供应商链接; ComponentLink1URL: http://www.szlcsc.com/product/details_25237.html; Package: 1206; Supplier: LC; SuppliersPartNumber: C24497
C51 C53 C59 = 0805 22uF (226) 20% 25V: 贴片电容; ComponentLink1Description: 供应商链接; ComponentLink1URL: http://www.szlcsc.com/product/details_46786.html; Package: 0805; Supplier: LC; SuppliersPartNumber: C45783
C54 C56 C62 = 0805 3.3nF (332) 10% 50V: 贴片电容; ComponentLink1Description: 供应商链接; ComponentLink1URL: http://www.szlcsc.com/product/details_54191.html; Package: 0805; Supplier: LC; SuppliersPartNumber: C53175
C55 C57 C63 = 1206 10uF (106) 10% 50V: 贴片电容; ComponentLink1Description: 供应商链接; ComponentLink1URL: http://www.szlcsc.com/product/details_14236.html; Package: 1206; Supplier: LC; SuppliersPartNumber: C13585
D2 = 0805 翠绿: 发光二极管; ComponentLink1Description: 供应商链接; ComponentLink1URL: http://www.szlcsc.com/product/details_2670.html; Package: 0805; Supplier: LC; SuppliersPartNumber: C2297
D3 D5 = SMA(DO-214AC) SS210: 二极管 TVS; ComponentLink1Description: 供应商链接; ComponentLink1URL: http://www.szlcsc.com/product/details_15669.html; Package: SMA(DO-214AC); Supplier: LC; SuppliersPartNumber: C14996
J1 = CONN_PWR_JACK2MM: CONN, PWR JACK DC, PLUG DIAM 2.0MM RA THD; MANF: CUI STACK; MANF_P#: PJ-202A, PJ-002AH, PJ-102AH, KLDX-0202; VALUE: DC_POWER_JACK
J_FT_AC J_FT_AD = Header 10: Header, 10-Pin; LatestRevisionDate: 17-Jul-2002; LatestRevisionNote: Re-released for DXP Platform.; Publisher: Altium Limited
J_FT_PWR = Header 4: Header, 4-Pin; LatestRevisionDate: 17-Jul-2002; LatestRevisionNote: Re-released for DXP Platform.; Publisher: Altium Limited
L1-L3 = 252012CDMCDS2R2MC: Inductor; Manufacturer_Name: Sumida; Manufacturer_Part_Number: 252012CDMCDS‐2R2MC; Datasheet Link: https://products.sumida.com/products/pdf/252012CDMCDDS%20(en).pdf; Height: 1.2mm
PS1-PS3 = TLV62130RGTR: Power Supply; Manufacturer_Name: Texas Instruments; Datasheet Link: http://www.ti.com/lit/gpn/tlv62130; Height: 1mm; Manufacturer_Part_Number: TLV62130RGTR; Arrow Part Number: TLV62130RGTR; Arrow Price/Stock: https://www.arrow.com/en/products/tlv62130rgtr/texas-instruments; Mouser Part Number: 595-TLV62130RGTR; Mouser Price/Stock: https://www.mouser.co.uk/ProductDetail/Texas-Instruments/TLV62130RGTR?qs=2UFnnMkojnVB1OajUwDmow%3D%3D
PWR_SEL = Header 3: Header, 3-Pin; LatestRevisionDate: 17-Jul-2002; LatestRevisionNote: Re-released for DXP Platform.; Publisher: Altium Limited
R32 R35 = 0805 330Ω (3300) 1%: 贴片电阻; ComponentLink1Description: 供应商链接; ComponentLink1URL: http://www.szlcsc.com/product/details_18318.html; Package: 0805; Supplier: LC; SuppliersPartNumber: C17630
R33 R39 = 1206 10KΩ (1002) 1%: 贴片电阻; ComponentLink1Description: 供应商链接; ComponentLink1URL: http://www.szlcsc.com/product/details_18590.html; Package: 1206; Supplier: LC; SuppliersPartNumber: C17902
R34 = 0805 4.99KΩ (4991) 1%: 贴片电阻; ComponentLink1Description: 供应商链接; ComponentLink1URL: http://www.szlcsc.com/product/details_18365.html; Package: 0805; Supplier: LC; SuppliersPartNumber: C17677
R36 = 0805 56KΩ (5602) 1%: 贴片电阻 56.2k; ComponentLink1Description: 供应商链接; ComponentLink1URL: http://www.szlcsc.com/product/details_18444.html; Package: 0805; Supplier: LC; SuppliersPartNumber: C17756
R37 = 0805 20KΩ (2002) 1%: 贴片电阻; ComponentLink1Description: 供应商链接; ComponentLink1URL: http://www.szlcsc.com/product/details_4735.html; Package: 0805; Supplier: LC; SuppliersPartNumber: C4328
R38 = 0805 18KΩ (1802) 1%: 贴片电阻; ComponentLink1Description: 供应商链接; ComponentLink1URL: http://www.szlcsc.com/product/details_18194.html; Package: 0805; Supplier: LC; SuppliersPartNumber: C17506
R41 = 0805 18KΩ (1802) 1%: 贴片电阻 18.7k; ComponentLink1Description: 供应商链接; ComponentLink1URL: http://www.szlcsc.com/product/details_18194.html; Package: 0805; Supplier: LC; SuppliersPartNumber: C17506
R42 R43 R45 R46 = 0805 0Ω (0R0) 1%: 贴片电阻; ComponentLink1Description: 供应商链接; ComponentLink1URL: http://www.szlcsc.com/product/details_18165.html; Package: 0805; Supplier: LC; SuppliersPartNumber: C17477
R44 = 0805 15KΩ (1502) 1%: 贴片电阻; ComponentLink1Description: 供应商链接; ComponentLink1URL: http://www.szlcsc.com/product/details_18163.html; Package: 0805; Supplier: LC; SuppliersPartNumber: C17475
SW_PWR = SWSLIDT_SPDT_S_8X4: SWITCH, SLIDE, SPDT, 8.6X4.3mm, THD; MANF_PART#: OS102011MS2QN1; MANF: C&K; DESC: DESCRIPTION; VALUE: SlideSwitch; ASSEMBLY: ASSEMBLY; PARAM: PARAM; PRICE: 0.4$

## Sheet Sheet6.SchDoc
size A
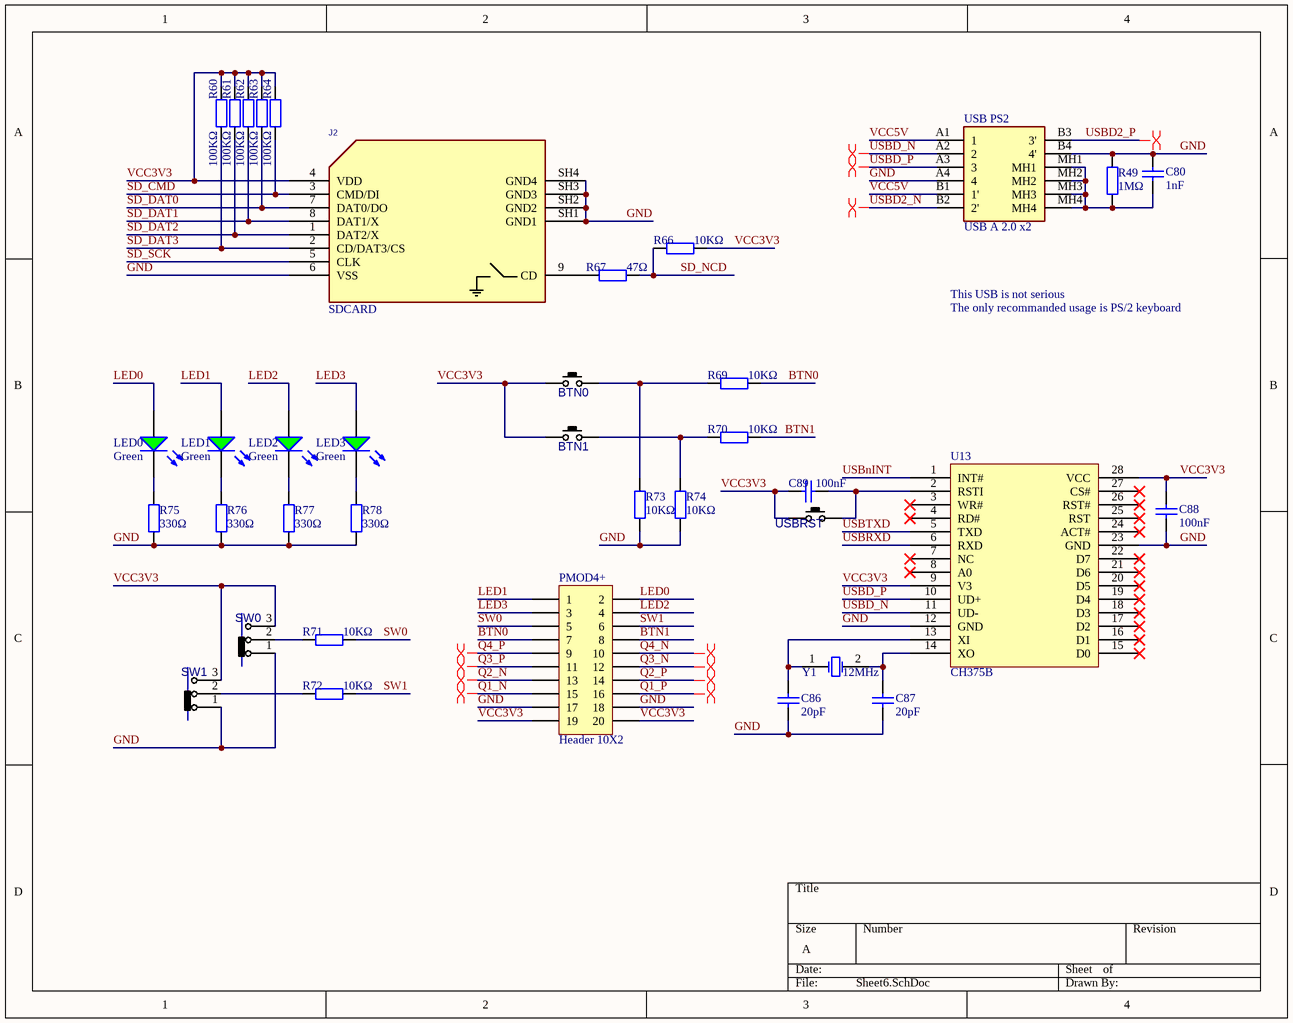
[diagram p4: Sheet6.SchDoc]

### Parts
BTN0  PUSHBUTTON  [SWPBS_SPST_6X3X5]  (value not drawn)
BTN1  PUSHBUTTON  [SWPBS_SPST_6X3X5]  (value not drawn)
C80  1nF  [0805_C]
C86  20pF  [0805_C]
C87  20pF  [0805_C]
C88  100nF  [1206_C]
C89  100nF  [1206_C]
J2  SDCARD  [SDMICRO_AT]
LED0  Green  [0805_LED_S1]
LED1  Green  [0805_LED_S1]
LED2  Green  [0805_LED_S1]
LED3  Green  [0805_LED_S1]
PMOD4+  Header 10X2  [HDR2X10]
R49  1MΩ  [0805_R]
R60  100KΩ  [1206_R]
R61  100KΩ  [1206_R]
R62  100KΩ  [1206_R]
R63  100KΩ  [1206_R]
R64  100KΩ  [1206_R]
R66  10KΩ  [1206_R]
R67  47Ω  [0805_R]
R69  10KΩ  [1206_R]
R70  10KΩ  [1206_R]
R71  10KΩ  [1206_R]
R72  10KΩ  [1206_R]
R73  10KΩ  [1206_R]
R74  10KΩ  [1206_R]
R75  330Ω  [0805_R]
R76  330Ω  [0805_R]
R77  330Ω  [0805_R]
R78  330Ω  [0805_R]
SW0  SlideSwitch  [SWSLIDT_SPDT_S_8X4]  (value not drawn)
SW1  SlideSwitch  [SWSLIDT_SPDT_S_8X4]  (value not drawn)
U13  CH375B  [SOIC-28_300mil]
USB_PS2  USB A 2.0 x2  [0672983090]
USBRST  PUSHBUTTON  [SWPBS_SPST_6X3X5]  (value not drawn)
Y1  12MHz  [SMD-5032_2P]

### Nets
BTN0: PMOD4+.7 R69.2
BTN1: PMOD4+.8 R70.2
GND: C80.1 C86.1 C87.1 C88.1 J2.6(VSS) J2.SH1(GND1) J2.SH2(GND2) J2.SH3(GND3) J2.SH4(GND4) PMOD4+.17 PMOD4+.18 R49.1 R73.1 R74.1 R75.1 R76.1 R77.1 R78.1 SW0.1(P1) SW1.1(P1) U13.12(GND) U13.23(GND) USB_PS2.A4(4) USB_PS2.B4(4')
LED0: LED0.A PMOD4+.2
LED1: LED1.A PMOD4+.1
LED2: LED2.A PMOD4+.4
LED3: LED3.A PMOD4+.3
Q1_N: PMOD4+.15
Q1_P: PMOD4+.16
Q2_N: PMOD4+.13
Q2_P: PMOD4+.14
Q3_N: PMOD4+.12
Q3_P: PMOD4+.11
Q4_N: PMOD4+.10
Q4_P: PMOD4+.9
SD_CMD: J2.3(CMD/DI) R64.1
SD_DAT0: J2.7(DAT0/DO) R63.1
SD_DAT1: J2.8(DAT1/X) R62.1
SD_DAT2: J2.1(DAT2/X) R61.1
SD_DAT3: J2.2(CD/DAT3/CS) R60.1
SD_NCD: R66.1 R67.2
SD_SCK: J2.5(CLK)
SW0: PMOD4+.5 R71.2
SW1: PMOD4+.6 R72.2
USBD2_N: USB_PS2.B2(2')
USBD2_P: USB_PS2.B3(3')
USBD_N: U13.11(UD-) USB_PS2.A2(2)
USBD_P: U13.10(UD+) USB_PS2.A3(3)
USBnINT: U13.1(INT#)
USBRXD: U13.6(RXD)
USBTXD: U13.5(TXD)
VCC3V3: BTN0.1(P1) BTN1.1(P1) C88.2 C89.2 J2.4(VDD) PMOD4+.19 PMOD4+.20 R60.2 R61.2 R62.2 R63.2 R64.2 R66.2 SW0.3(P4) SW1.3(P4) U13.9(V3) U13.28(VCC) USBRST.1(P1)
VCC5V: USB_PS2.A1(1) USB_PS2.B1(1')
NetBTN0_2: BTN0.2(P3) R69.1 R73.2
NetBTN1_2: BTN1.2(P3) R70.1 R74.2
NetC80_2: C80.2 R49.2 USB_PS2.MH1 USB_PS2.MH2 USB_PS2.MH3 USB_PS2.MH4
NetC86_2: C86.2 U13.13(XI) Y1.1(OSC1)
NetC87_2: C87.2 U13.14(XO) Y1.2(OSC2)
NetC89_1: C89.1 U13.2(RSTI) USBRST.2(P3)
NetJ2_9: J2.9(CD) R67.1
NetLED0_K: LED0.K R75.2
NetLED1_K: LED1.K R76.2
NetLED2_K: LED2.K R77.2
NetLED3_K: LED3.K R78.2
NetR71_1: R71.1 SW0.2(P3)
NetR72_1: R72.1 SW1.2(P3)

Not connected (* = marked no-connect by the designer): U13 3(WR#)* 4(RD#)* 7(NC)* 8(A0)* 15(D0)* 16(D1)* 17(D2)* 18(D3)* 19(D4)* 20(D5)* 21(D6)* 22(D7)* 24(ACT#)* 25(RST)* 26(RST#)* 27(CS#)*

### Layout directives
differential pair: Q1_N, Q1_P, Q2_N, Q2_P, Q3_N, Q3_P, Q4_N, Q4_P, USBD2_N, USBD2_P, USBD_N, USBD_P

### Notes on the sheet
- This USB is not serious
- The only recommanded usage is PS/2 keyboard

### Library data of the parts
BTN0 BTN1 USBRST = SWPBS_SPST_6X3X4: SWITCH, PUSH BUTTON, TACTILE, SMD, SPST, 6X3.5X4.3mm; MANF: Panasonic; DESC: DESCRIPTION; MANF_P#: EVQ-PNF04M; VALUE: PUSHBUTTON; ASSEMBLY: ASSEMBLY; PARAM: PARAM; PRICE: PRICE
C80 = 0805 1nF (102) 10% 50V: 贴片电容; ComponentLink1Description: 供应商链接; ComponentLink1URL: http://www.szlcsc.com/product/details_52223.html; Package: 0805; Supplier: LC; SuppliersPartNumber: C51210
C86 C87 = 0805 20pF (200) 5% 50V: 贴片电容; ComponentLink1Description: 供应商链接; ComponentLink1URL: http://www.szlcsc.com/product/details_2150.html; Package: 0805; Supplier: LC; SuppliersPartNumber: C1798
C88 C89 = 1206 100nF (104) 10% 50V: 贴片电容; ComponentLink1Description: 供应商链接; ComponentLink1URL: http://www.szlcsc.com/product/details_25237.html; Package: 1206; Supplier: LC; SuppliersPartNumber: C24497
J2 = SOCKET_SDMICRO_AT: SD MICRO exist in Iran, Attend 112J-TDAR-R01; MANF: Attend; MANF_P#: 112J-TDAR-R01; VALUE: SDCARD
LED0-LED3 = 0805 翠绿: 发光二极管; ComponentLink1Description: 供应商链接; ComponentLink1URL: http://www.szlcsc.com/product/details_2670.html; Package: 0805; Supplier: LC; SuppliersPartNumber: C2297
PMOD4+ = Header 10X2: Header, 10-Pin, Dual row; LatestRevisionDate: 17-Jul-2002; LatestRevisionNote: Re-released for DXP Platform.; Publisher: Altium Limited
R49 = 0805 1MΩ (1004) 1%: 贴片电阻; ComponentLink1Description: 供应商链接; ComponentLink1URL: http://www.szlcsc.com/product/details_18202.html; Package: 0805; Supplier: LC; SuppliersPartNumber: C17514
R60-R64 = 1206 100KΩ (1003) 1%: 贴片电阻; ComponentLink1Description: 供应商链接; ComponentLink1URL: http://www.szlcsc.com/product/details_18588.html; Package: 1206; Supplier: LC; SuppliersPartNumber: C17900
R66 R69-R74 = 1206 10KΩ (1002) 1%: 贴片电阻; ComponentLink1Description: 供应商链接; ComponentLink1URL: http://www.szlcsc.com/product/details_18590.html; Package: 1206; Supplier: LC; SuppliersPartNumber: C17902
R67 = 0805 47Ω (47R0) 1%: 贴片电阻; ComponentLink1Description: 供应商链接; ComponentLink1URL: http://www.szlcsc.com/product/details_18402.html; Package: 0805; Supplier: LC; SuppliersPartNumber: C17714
R75-R78 = 0805 330Ω (3300) 1%: 贴片电阻; ComponentLink1Description: 供应商链接; ComponentLink1URL: http://www.szlcsc.com/product/details_18318.html; Package: 0805; Supplier: LC; SuppliersPartNumber: C17630
SW0 SW1 = SWSLIDT_SPDT_S_8X4: as SW_PWR on sheet Sheet4; VALUE: SlideSwitch; ASSEMBLY: ASSEMBLY; PARAM: PARAM; PRICE: 0.4$
U13 = CH376S_[C14166]: USB; ComponentLink1Description: 供应商链接; ComponentLink1URL: http://www.szlcsc.com/product/details_14823.html; Package: SOIC-28_300mil; Supplier: LC; SuppliersPartNumber: C14166
USB_PS2 = 0672983090: Connector; Manufacturer_Name: Molex; Datasheet Link: https://componentsearchengine.com/Datasheets/1/0672983090.pdf; Height: 15.59mm; Manufacturer_Part_Number: 0672983090; Arrow Part Number: 0672983090; Arrow Price/Stock: https://www.arrow.com/en/products/0672983090/molex; Mouser Part Number: N/A; Mouser Price/Stock: https://www.mouser.co.uk/ProductDetail/Molex/0672983090?qs=PBcRNPEHKspNkRSIiHq%2Fdg%3D%3D
Y1 = SMD-5032_2P 11.0592MHZ 20PF 20PPM: 贴片晶振; ComponentLink1Description: 供应商链接; ComponentLink1URL: http://www.szlcsc.com/product/details_53039.html; Package: SMD-5032_2P; Supplier: LC; SuppliersPartNumber: C52026

## Sheet Sheet5.SchDoc
size A
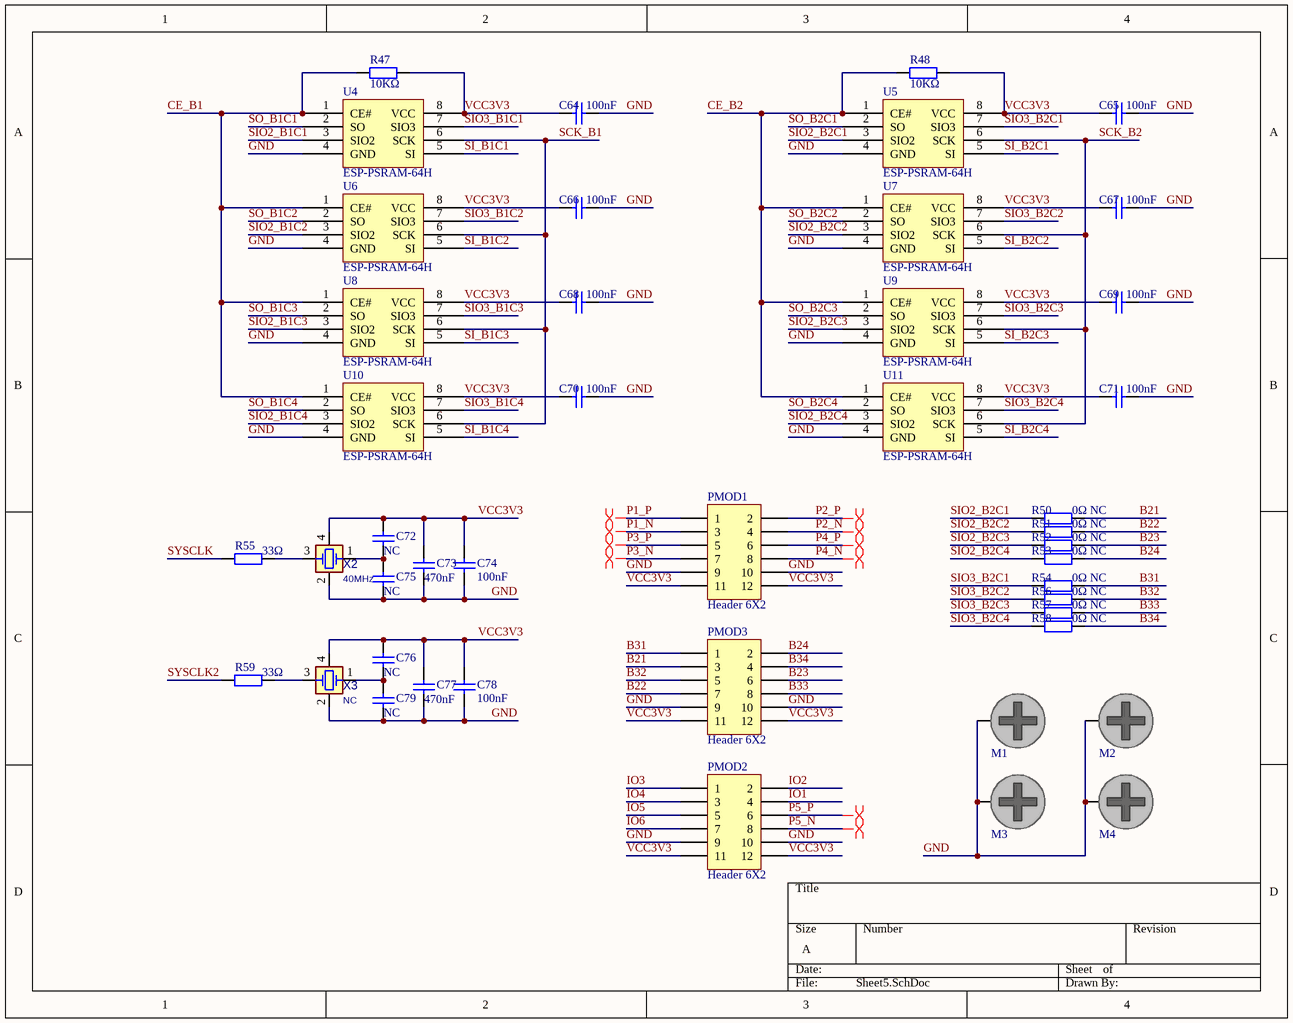
[diagram p5: Sheet5.SchDoc]

### Parts
C64  100nF  [1206_C]
C65  100nF  [1206_C]
C66  100nF  [1206_C]
C67  100nF  [1206_C]
C68  100nF  [1206_C]
C69  100nF  [1206_C]
C70  100nF  [1206_C]
C71  100nF  [1206_C]
C72  NC  [0402_C]
C73  470nF  [0402_C]
C74  100nF  [1206_C]
C75  NC  [0402_C]
C76  NC  [0402_C]
C77  470nF  [0402_C]
C78  100nF  [1206_C]
C79  NC  [0402_C]
M1  DNP/MH  [SCMH_M2]  (value not drawn)  (no BOM)
M2  DNP/MH  [SCMH_M2]  (value not drawn)  (no BOM)
M3  DNP/MH  [SCMH_M2]  (value not drawn)  (no BOM)
M4  DNP/MH  [SCMH_M2]  (value not drawn)  (no BOM)
PMOD1  Header 6X2  [HDR2X6]
PMOD2  Header 6X2  [HDR2X6]
PMOD3  Header 6X2  [HDR2X6]
R47  10KΩ  [1206_R]
R48  10KΩ  [1206_R]
R50  0Ω NC  [0603_R]
R51  0Ω NC  [0603_R]
R52  0Ω NC  [0603_R]
R53  0Ω NC  [0603_R]
R54  0Ω NC  [0603_R]
R55  33Ω  [0603_R]
R56  0Ω NC  [0603_R]
R57  0Ω NC  [0603_R]
R58  0Ω NC  [0603_R]
R59  33Ω  [0603_R]
U4  ESP-PSRAM-64H  [SOIC-8_150mil]
U5  ESP-PSRAM-64H  [SOIC-8_150mil]
U6  ESP-PSRAM-64H  [SOIC-8_150mil]
U7  ESP-PSRAM-64H  [SOIC-8_150mil]
U8  ESP-PSRAM-64H  [SOIC-8_150mil]
U9  ESP-PSRAM-64H  [SOIC-8_150mil]
U10  ESP-PSRAM-64H  [SOIC-8_150mil]
U11  ESP-PSRAM-64H  [SOIC-8_150mil]
X2  40MHz  [XTL_4_3225]
X3  NC  [XTL_4_3225]

### Nets
B21: PMOD3.3 R50.2
B22: PMOD3.7 R51.2
B23: PMOD3.6 R52.2
B24: PMOD3.2 R53.2
B31: PMOD3.1 R54.2
B32: PMOD3.5 R56.2
B33: PMOD3.8 R57.2
B34: PMOD3.4 R58.2
CE_B1: R47.2 U4.1(CE#) U6.1(CE#) U8.1(CE#) U10.1(CE#)
CE_B2: R48.2 U5.1(CE#) U7.1(CE#) U9.1(CE#) U11.1(CE#)
GND: C64.1 C65.1 C66.1 C67.1 C68.1 C69.1 C70.1 C71.1 C73.2 C74.1 C75.2 C77.2 C78.1 C79.2 M1.1 M2.1 M3.1 M4.1 PMOD1.9 PMOD1.10 PMOD2.9 PMOD2.10 PMOD3.9 PMOD3.10 U4.4(GND) U5.4(GND) U6.4(GND) U7.4(GND) U8.4(GND) U9.4(GND) U10.4(GND) U11.4(GND) X2.2(GND1) X3.2(GND1)
IO1: PMOD2.4
IO2: PMOD2.2
IO3: PMOD2.1
IO4: PMOD2.3
IO5: PMOD2.5
IO6: PMOD2.7
P1_N: PMOD1.3
P1_P: PMOD1.1
P2_N: PMOD1.4
P2_P: PMOD1.2
P3_N: PMOD1.7
P3_P: PMOD1.5
P4_N: PMOD1.8
P4_P: PMOD1.6
P5_N: PMOD2.8
P5_P: PMOD2.6
SCK_B1: U4.6(SCK) U6.6(SCK) U8.6(SCK) U10.6(SCK)
SCK_B2: U5.6(SCK) U7.6(SCK) U9.6(SCK) U11.6(SCK)
SI_B1C1: U4.5(SI)
SI_B1C2: U6.5(SI)
SI_B1C3: U8.5(SI)
SI_B1C4: U10.5(SI)
SI_B2C1: U5.5(SI)
SI_B2C2: U7.5(SI)
SI_B2C3: U9.5(SI)
SI_B2C4: U11.5(SI)
SIO2_B1C1: U4.3(SIO2)
SIO2_B1C2: U6.3(SIO2)
SIO2_B1C3: U8.3(SIO2)
SIO2_B1C4: U10.3(SIO2)
SIO2_B2C1: R50.1 U5.3(SIO2)
SIO2_B2C2: R51.1 U7.3(SIO2)
SIO2_B2C3: R52.1 U9.3(SIO2)
SIO2_B2C4: R53.1 U11.3(SIO2)
SIO3_B1C1: U4.7(SIO3)
SIO3_B1C2: U6.7(SIO3)
SIO3_B1C3: U8.7(SIO3)
SIO3_B1C4: U10.7(SIO3)
SIO3_B2C1: R54.1 U5.7(SIO3)
SIO3_B2C2: R56.1 U7.7(SIO3)
SIO3_B2C3: R57.1 U9.7(SIO3)
SIO3_B2C4: R58.1 U11.7(SIO3)
SO_B1C1: U4.2(SO)
SO_B1C2: U6.2(SO)
SO_B1C3: U8.2(SO)
SO_B1C4: U10.2(SO)
SO_B2C1: U5.2(SO)
SO_B2C2: U7.2(SO)
SO_B2C3: U9.2(SO)
SO_B2C4: U11.2(SO)
SYSCLK: R55.1
SYSCLK2: R59.1
VCC3V3: C64.2 C65.2 C66.2 C67.2 C68.2 C69.2 C70.2 C71.2 C72.1 C73.1 C74.2 C76.1 C77.1 C78.2 PMOD1.11 PMOD1.12 PMOD2.11 PMOD2.12 PMOD3.11 PMOD3.12 R47.1 R48.1 U4.8(VCC) U5.8(VCC) U6.8(VCC) U7.8(VCC) U8.8(VCC) U9.8(VCC) U10.8(VCC) U11.8(VCC) X2.4(GND2) X3.4(GND2)
NetC72_2: C72.2 C75.1 X2.1(XA)
NetC76_2: C76.2 C79.1 X3.1(XA)
NetR55_2: R55.2 X2.3(XB)
NetR59_2: R59.2 X3.3(XB)

### Layout directives
differential pair: P1_N, P1_P, P2_N, P2_P, P3_N, P3_P, P4_N, P4_P, P5_N, P5_P

### Library data of the parts
C64-C71 C74 C78 = 1206 100nF (104) 10% 50V: 贴片电容; ComponentLink1Description: 供应商链接; ComponentLink1URL: http://www.szlcsc.com/product/details_25237.html; Package: 1206; Supplier: LC; SuppliersPartNumber: C24497
C72 C73 C75-C77 C79 = 0402 470nF (474) 10% 10V: 贴片电容; ComponentLink1Description: 供应商链接; ComponentLink1URL: http://www.szlcsc.com/product/details_48344.html; Package: 0402; Supplier: LC; SuppliersPartNumber: C47339
M1-M4 = SCMH_M2: SCREW mouting, M2, 2.0mm diameter and 4.0mm PanHead; ASSEMBLY: DNP; VALUE: DNP/MH
PMOD1-PMOD3 = Header 6X2: Header, 6-Pin, Dual row; LatestRevisionDate: 17-Jul-2002; LatestRevisionNote: Re-released for DXP Platform.; Publisher: Altium Limited
R47 R48 = 1206 10KΩ (1002) 1%: 贴片电阻; ComponentLink1Description: 供应商链接; ComponentLink1URL: http://www.szlcsc.com/product/details_18590.html; Package: 1206; Supplier: LC; SuppliersPartNumber: C17902
R50-R54 R56-R58 = 0603 0Ω (0R0) 1%: 贴片电阻; ComponentLink1Description: 供应商链接; ComponentLink1URL: http://www.szlcsc.com/product/details_21903.html; Package: 0603; Supplier: LC; SuppliersPartNumber: C21189
R55 R59 = 0603 33Ω (33R0) 1%: 贴片电阻; ComponentLink1Description: 供应商链接; ComponentLink1URL: http://www.szlcsc.com/product/details_23867.html; Package: 0603; Supplier: LC; SuppliersPartNumber: C23140
U4-U11 = EEPROM/AT24C256C-SSHL-T_[C6482]: PSRAM, 150mil SOP-8; ComponentLink1Description: 供应商链接; ComponentLink1URL: http://www.szlcsc.com/product/details_6947.html; Package: SOIC-8_150mil; Supplier: LC; SuppliersPartNumber: C6482
X2 X3 = XTL_4_40MHz_3225A: as X1 on sheet Sheet2; ASSEMBLY: ASSEMBLY; PRICE: 0.6$
  X2: VALUE: 40MHz
  X3: VALUE: NC

## Sheet Sheet7.SchDoc
size A
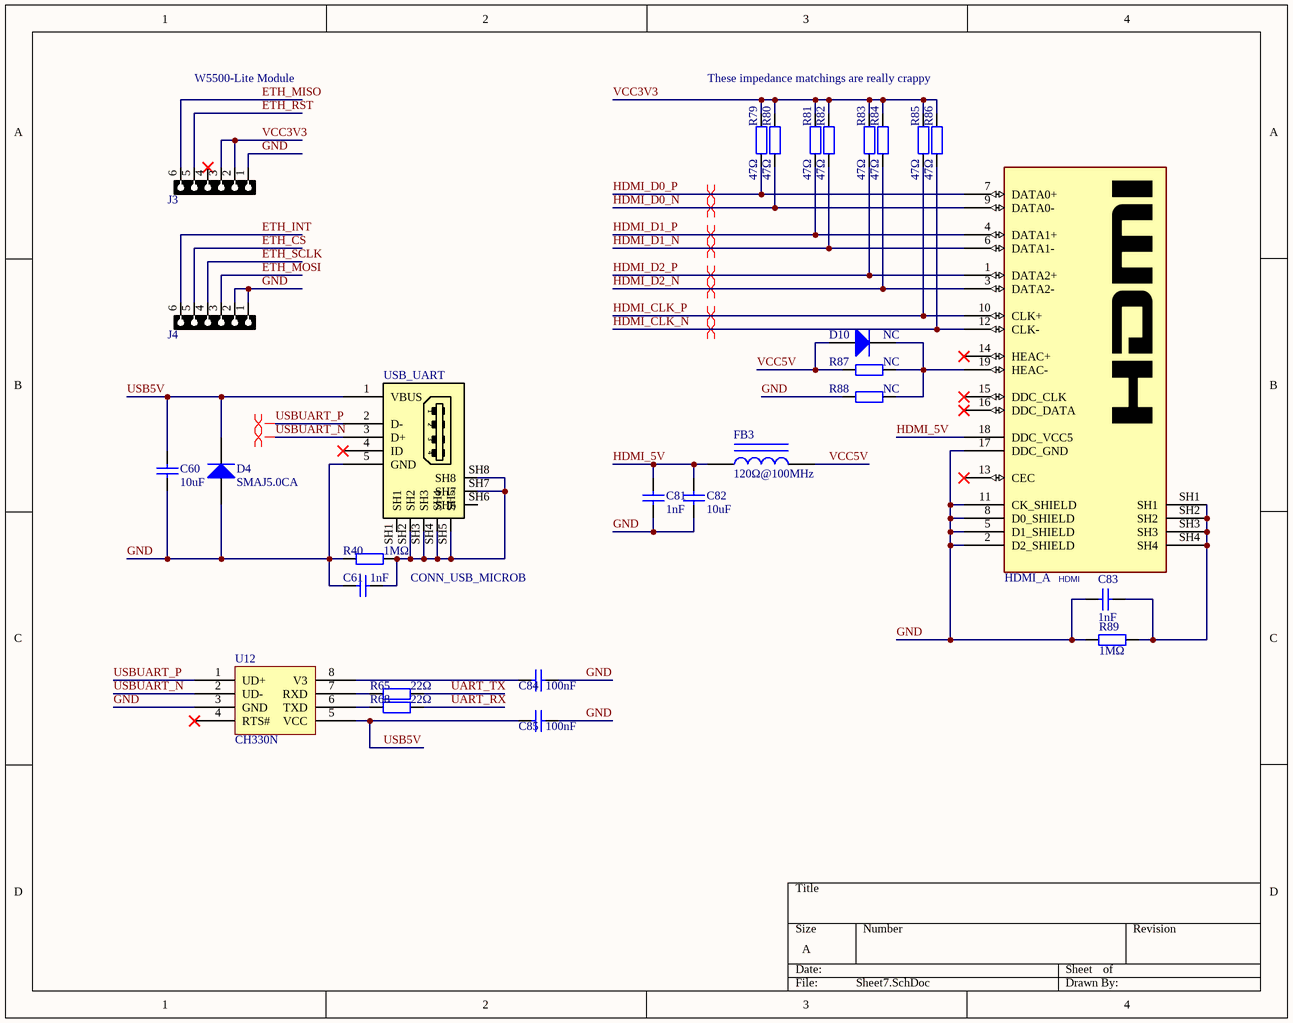
[diagram p6: Sheet7.SchDoc]

### Parts
C60  10uF  [1206_C]
C61  1nF  [0805_C]
C81  1nF  [0805_C]
C82  10uF  [0603_C]
C83  1nF  [0805_C]
C84  100nF  [1206_C]
C85  100nF  [1206_C]
D4  SMAJ5.0CA  [SMA(DO-214AC)_S1]
D10  NC  [SMA(DO-214AC)_S1]
FB3  120Ω@100MHz  [0805_L]
HDMI  HDMI_A  [HDMI_A]
J3  HDRF6  [HDR_F_1X6]  (value not drawn)
J4  HDRF6  [HDR_F_1X6]  (value not drawn)
R40  1MΩ  [0805_R]
R65  22Ω  [1206_R]
R68  22Ω  [1206_R]
R79  47Ω  [0805_R]
R80  47Ω  [0805_R]
R81  47Ω  [0805_R]
R82  47Ω  [0805_R]
R83  47Ω  [0805_R]
R84  47Ω  [0805_R]
R85  47Ω  [0805_R]
R86  47Ω  [0805_R]
R87  NC  [0805_R]
R88  NC  [0805_R]
R89  1MΩ  [0805_R]
U12  CH330N  [SOIC-8_150mil]
USB_UART  CONN_USB_MICROB  [USB_MICRO_B_BM_SHT1]

### Nets
ETH_CS: J4.5
ETH_INT: J4.6
ETH_MISO: J3.6
ETH_MOSI: J4.3
ETH_RST: J3.5
ETH_SCLK: J4.4
GND: C60.1 C61.1 C81.2 C82.1 C83.2 C84.2 C85.2 D4.1(A) HDMI.2(D2_SHIELD) HDMI.5(D1_SHIELD) HDMI.8(D0_SHIELD) HDMI.11(CK_SHIELD) HDMI.17(DDC_GND) J3.1 J4.1 J4.2 R40.1 R88.2 R89.2 U12.3(GND) USB_UART.5(GND)
HDMI_5V: C81.1 C82.2 FB3.1 HDMI.18(DDC_VCC5)
HDMI_CLK_N: HDMI.12(CLK-) R86.1
HDMI_CLK_P: HDMI.10(CLK+) R85.1
HDMI_D0_N: HDMI.9(DATA0-) R80.1
HDMI_D0_P: HDMI.7(DATA0+) R79.1
HDMI_D1_N: HDMI.6(DATA1-) R82.1
HDMI_D1_P: HDMI.4(DATA1+) R81.1
HDMI_D2_N: HDMI.3(DATA2-) R84.1
HDMI_D2_P: HDMI.1(DATA2+) R83.1
UART_RX: R68.2
UART_TX: R65.2
USB5V: C60.2 C85.1 D4.2(K) U12.5(VCC) USB_UART.1(VBUS)
USBUART_N: U12.2(UD-) USB_UART.3(D+)
USBUART_P: U12.1(UD+) USB_UART.2(D-)
VCC3V3: J3.2 J3.3 R79.2 R80.2 R81.2 R82.2 R83.2 R84.2 R85.2 R86.2
VCC5V: D10.1(A) FB3.2 R87.2
NetC61_2: C61.2 R40.2 USB_UART.SH2 USB_UART.SH3 USB_UART.SH4 USB_UART.SH5 USB_UART.SH7 USB_UART.SH8
NetC83_1: C83.1 HDMI.SH1 HDMI.SH2 HDMI.SH3 HDMI.SH4 R89.1
NetC84_1: C84.1 U12.8(V3)
NetD10_2: D10.2(K) HDMI.19(HEAC-) R87.1 R88.1
NetR65_1: R65.1 U12.7(RXD)
NetR68_1: R68.1 U12.6(TXD)

Not connected (* = marked no-connect by the designer): HDMI 13(CEC)* 14(HEAC+)* 15(DDC_CLK)* 16(DDC_DATA)*; J3 4*; U12 4(RTS#)*; USB_UART 4(ID)* SH1 SH6

### Layout directives
differential pair: HDMI_CLK_N, HDMI_CLK_P, HDMI_D0_N, HDMI_D0_P, HDMI_D1_N, HDMI_D1_P, HDMI_D2_N, HDMI_D2_P, USBUART_N, USBUART_P

### Notes on the sheet
- W5500-Lite Module
- These impedance matchings are really crappy

### Library data of the parts
C60 = 1206 10uF (106) 10% 50V: 贴片电容; ComponentLink1Description: 供应商链接; ComponentLink1URL: http://www.szlcsc.com/product/details_14236.html; Package: 1206; Supplier: LC; SuppliersPartNumber: C13585
C61 C81 C83 = 0805 1nF (102) 10% 50V: 贴片电容; ComponentLink1Description: 供应商链接; ComponentLink1URL: http://www.szlcsc.com/product/details_52223.html; Package: 0805; Supplier: LC; SuppliersPartNumber: C51210
C82 = 0603 10uF (106) 10% 10V: 贴片电容; ComponentLink1Description: 供应商链接; ComponentLink1URL: http://www.szlcsc.com/product/details_20411.html; Package: 0603; Supplier: LC; SuppliersPartNumber: C19702
C84 C85 = 1206 100nF (104) 10% 50V: 贴片电容; ComponentLink1Description: 供应商链接; ComponentLink1URL: http://www.szlcsc.com/product/details_25237.html; Package: 1206; Supplier: LC; SuppliersPartNumber: C24497
D4 D10 = SMA(DO-214AC) SS210: 二极管 TVS; ComponentLink1Description: 供应商链接; ComponentLink1URL: http://www.szlcsc.com/product/details_15669.html; Package: SMA(DO-214AC); Supplier: LC; SuppliersPartNumber: C14996
FB3 = 0805 600Ω 25% 100MHz: 贴片磁珠; ComponentLink1Description: 供应商链接; ComponentLink1URL: http://www.szlcsc.com/product/details_1369.html; Package: 0805; Supplier: LC; SuppliersPartNumber: C1017
HDMI = CONN_HDMI_A: CONN, HDMI, Receptacle, TYPE A, 19P, RIGH-ANGLE; MANF: Molex, WURTH; MANF_P#: 47151-0001, 500254-1927, 685119134923; PARAM: Receptacle, 19P, RIGH-ANGLE; PRICE: 2.57$; VALUE: HDMI_A
J3 J4 = HDR_F_1X6: CONN, HEADER, Female, pitch: 2.54mm, 6POS; VALUE: HDRF6
R40 R87-R89 = 0805 1MΩ (1004) 1%: 贴片电阻; ComponentLink1Description: 供应商链接; ComponentLink1URL: http://www.szlcsc.com/product/details_18202.html; Package: 0805; Supplier: LC; SuppliersPartNumber: C17514
R65 R68 = 1206 22Ω (22R0) 1%: 贴片电阻; ComponentLink1Description: 供应商链接; ComponentLink1URL: http://www.szlcsc.com/product/details_18646.html; Package: 1206; Supplier: LC; SuppliersPartNumber: C17958
R79-R86 = 0805 47Ω (47R0) 1%: 贴片电阻; ComponentLink1Description: 供应商链接; ComponentLink1URL: http://www.szlcsc.com/product/details_18402.html; Package: 0805; Supplier: LC; SuppliersPartNumber: C17714
U12 = EEPROM/AT24C256C-SSHL-T_[C6482]: PSRAM, 150mil SOP-8; ComponentLink1Description: 供应商链接; ComponentLink1URL: http://www.szlcsc.com/product/details_6947.html; Package: SOIC-8_150mil; Supplier: LC; SuppliersPartNumber: C6482
USB_UART = CONN_USB_MICRO_B_BM_SHT1: CONN, USB, MICRO B, R/A, SMD, BOTTOM MOUNT, SHT; MANF_P#: 47590-0001; MANF: MOLEX; VALUE: CONN_USB_MICROB